# EAGLE board stm32 v1.2 (EAGLE 9.6.2), part 1 of 2
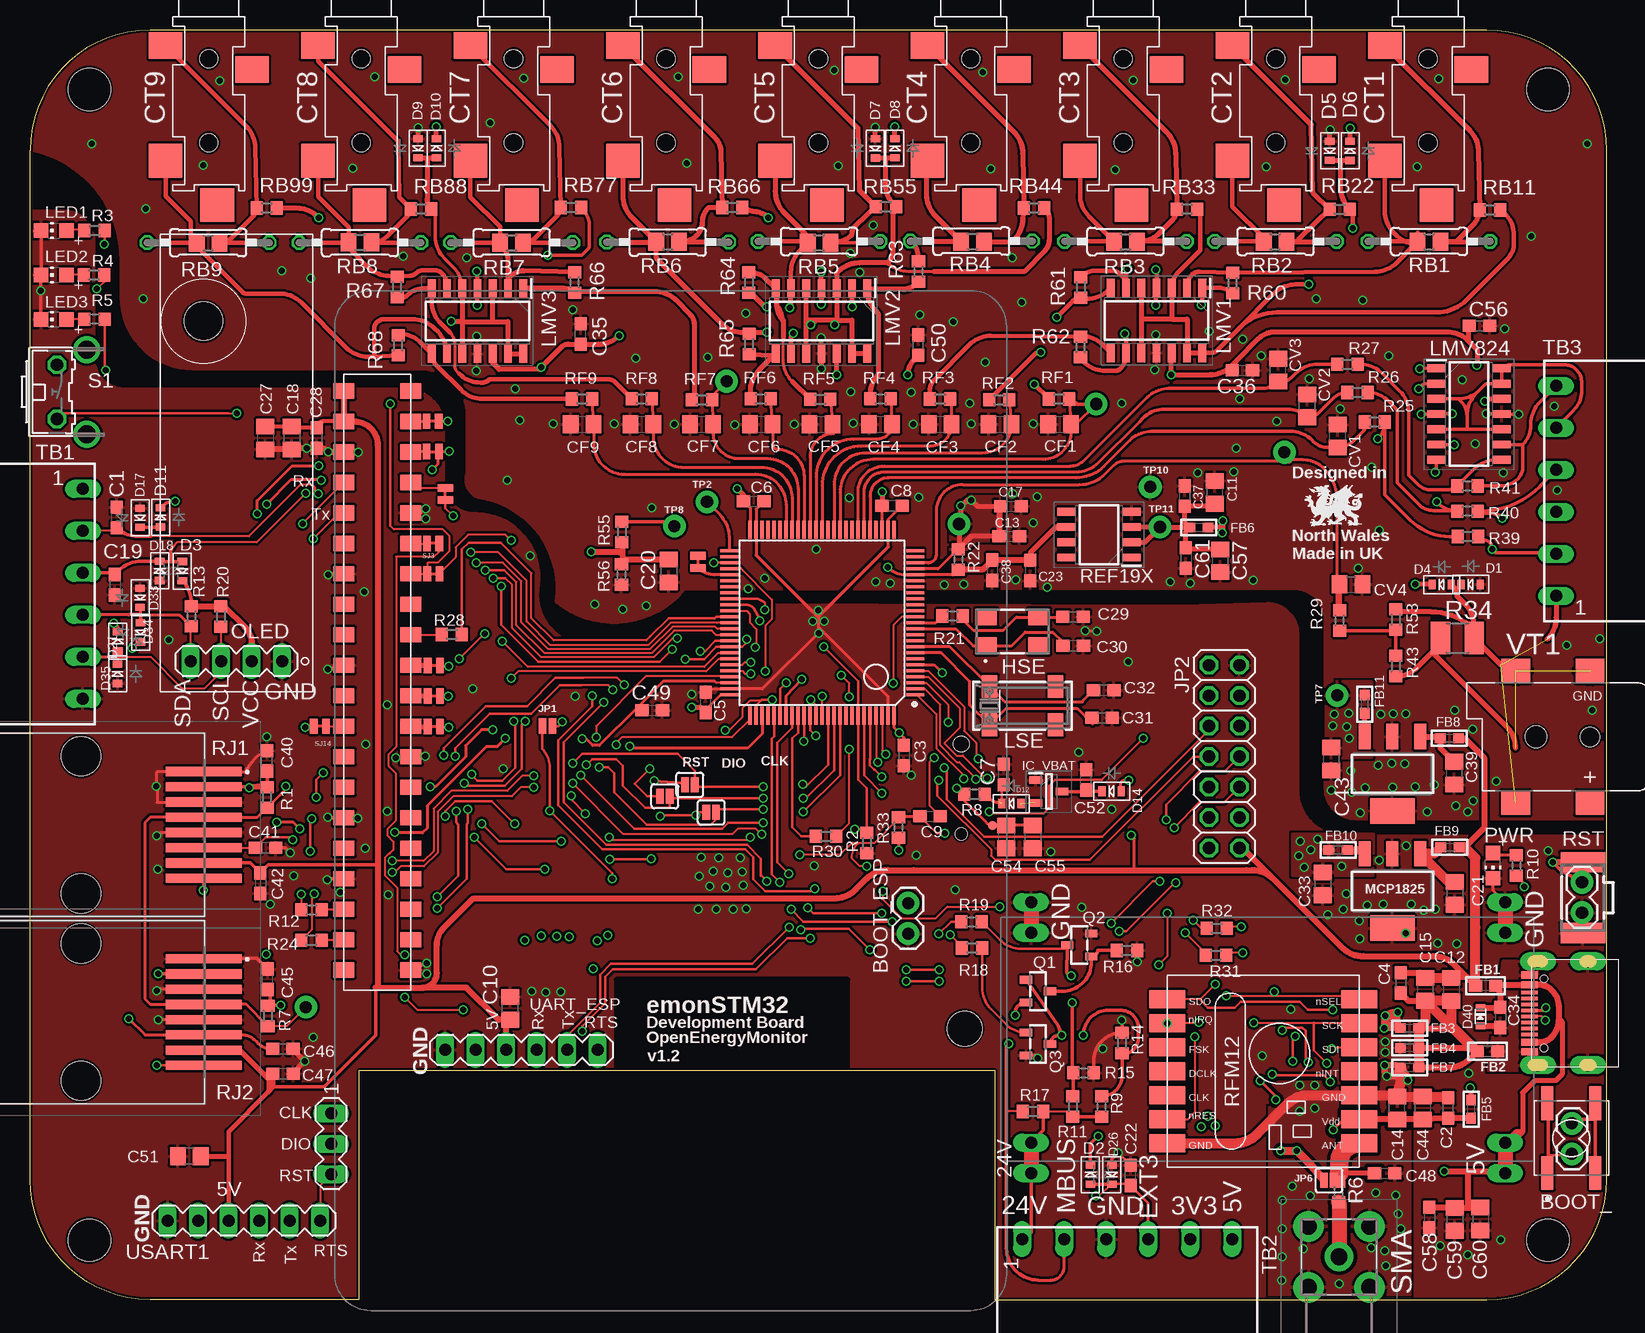
[diagram p5: board, top side]
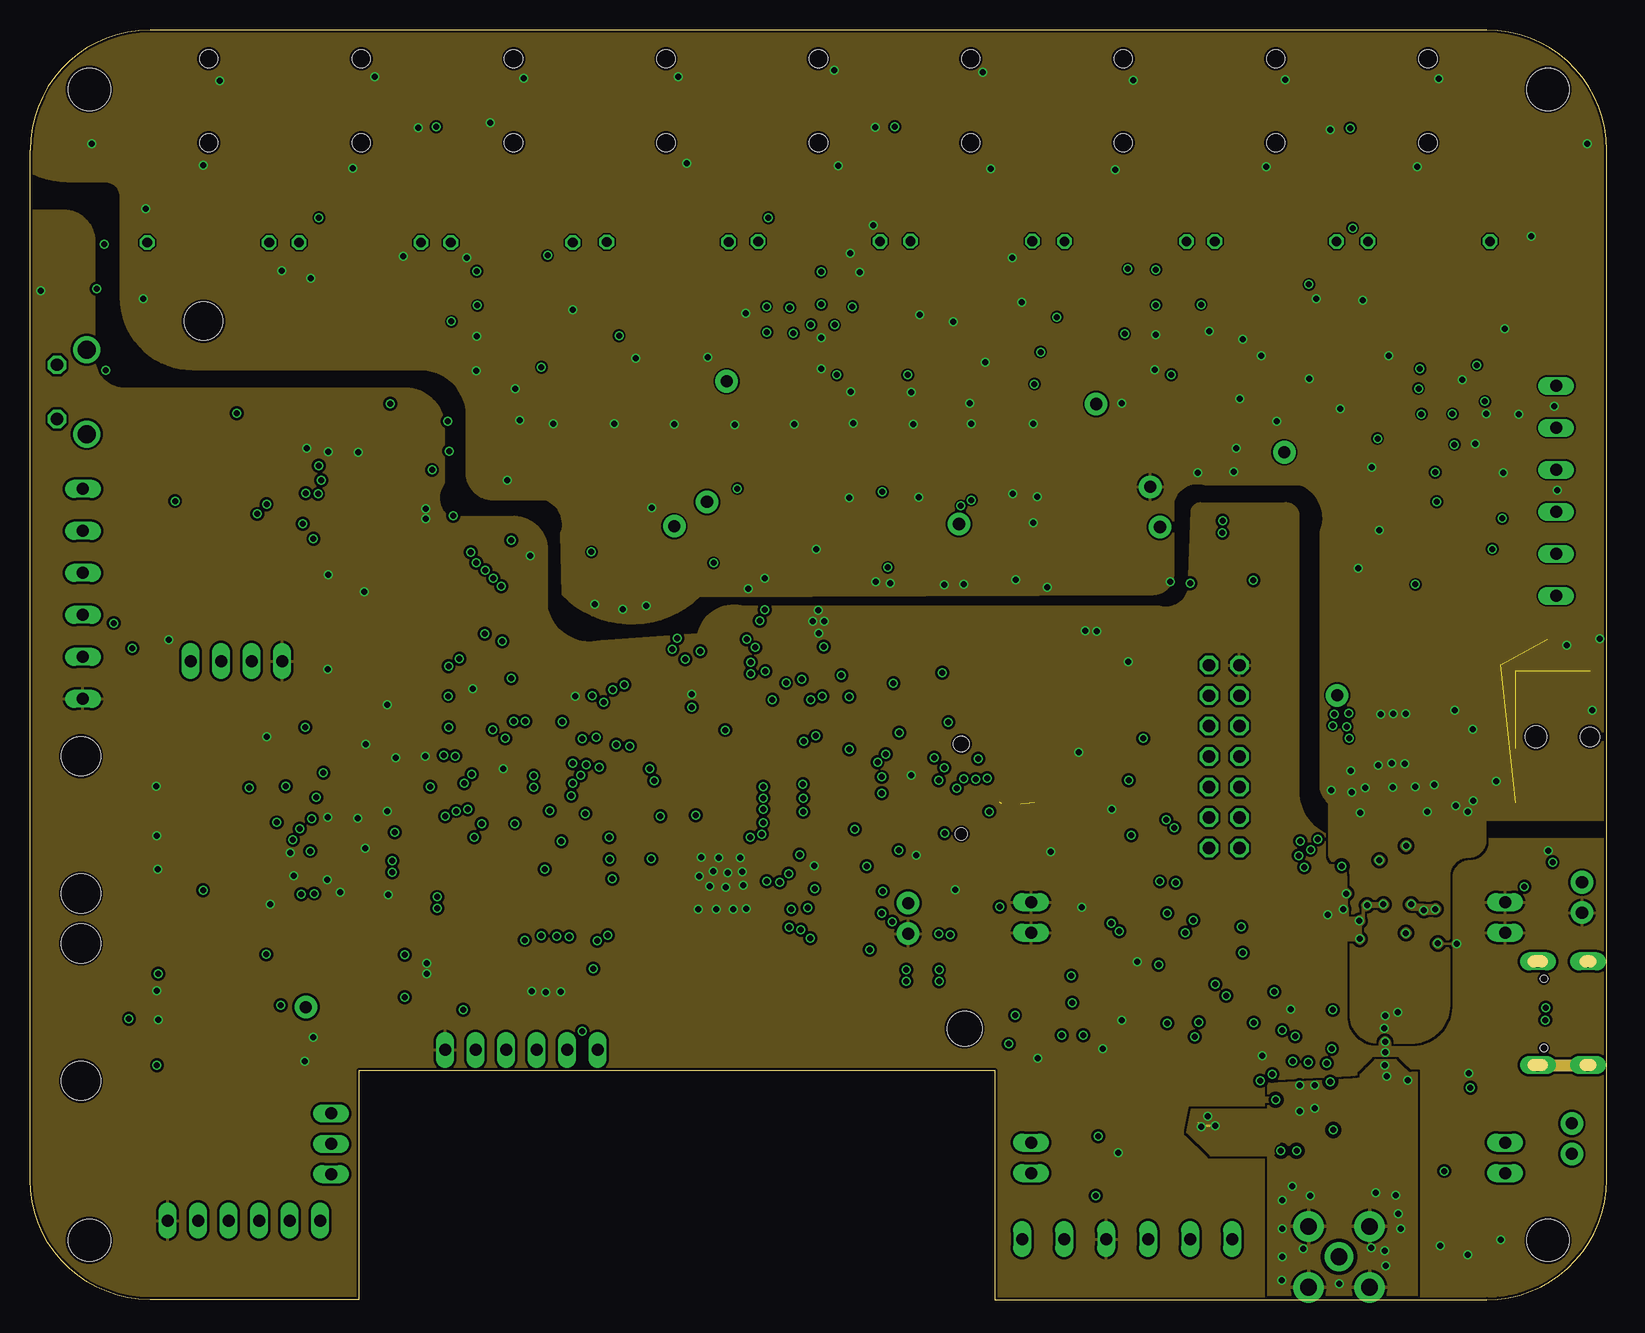
[diagram p6: board, inner layer GND]
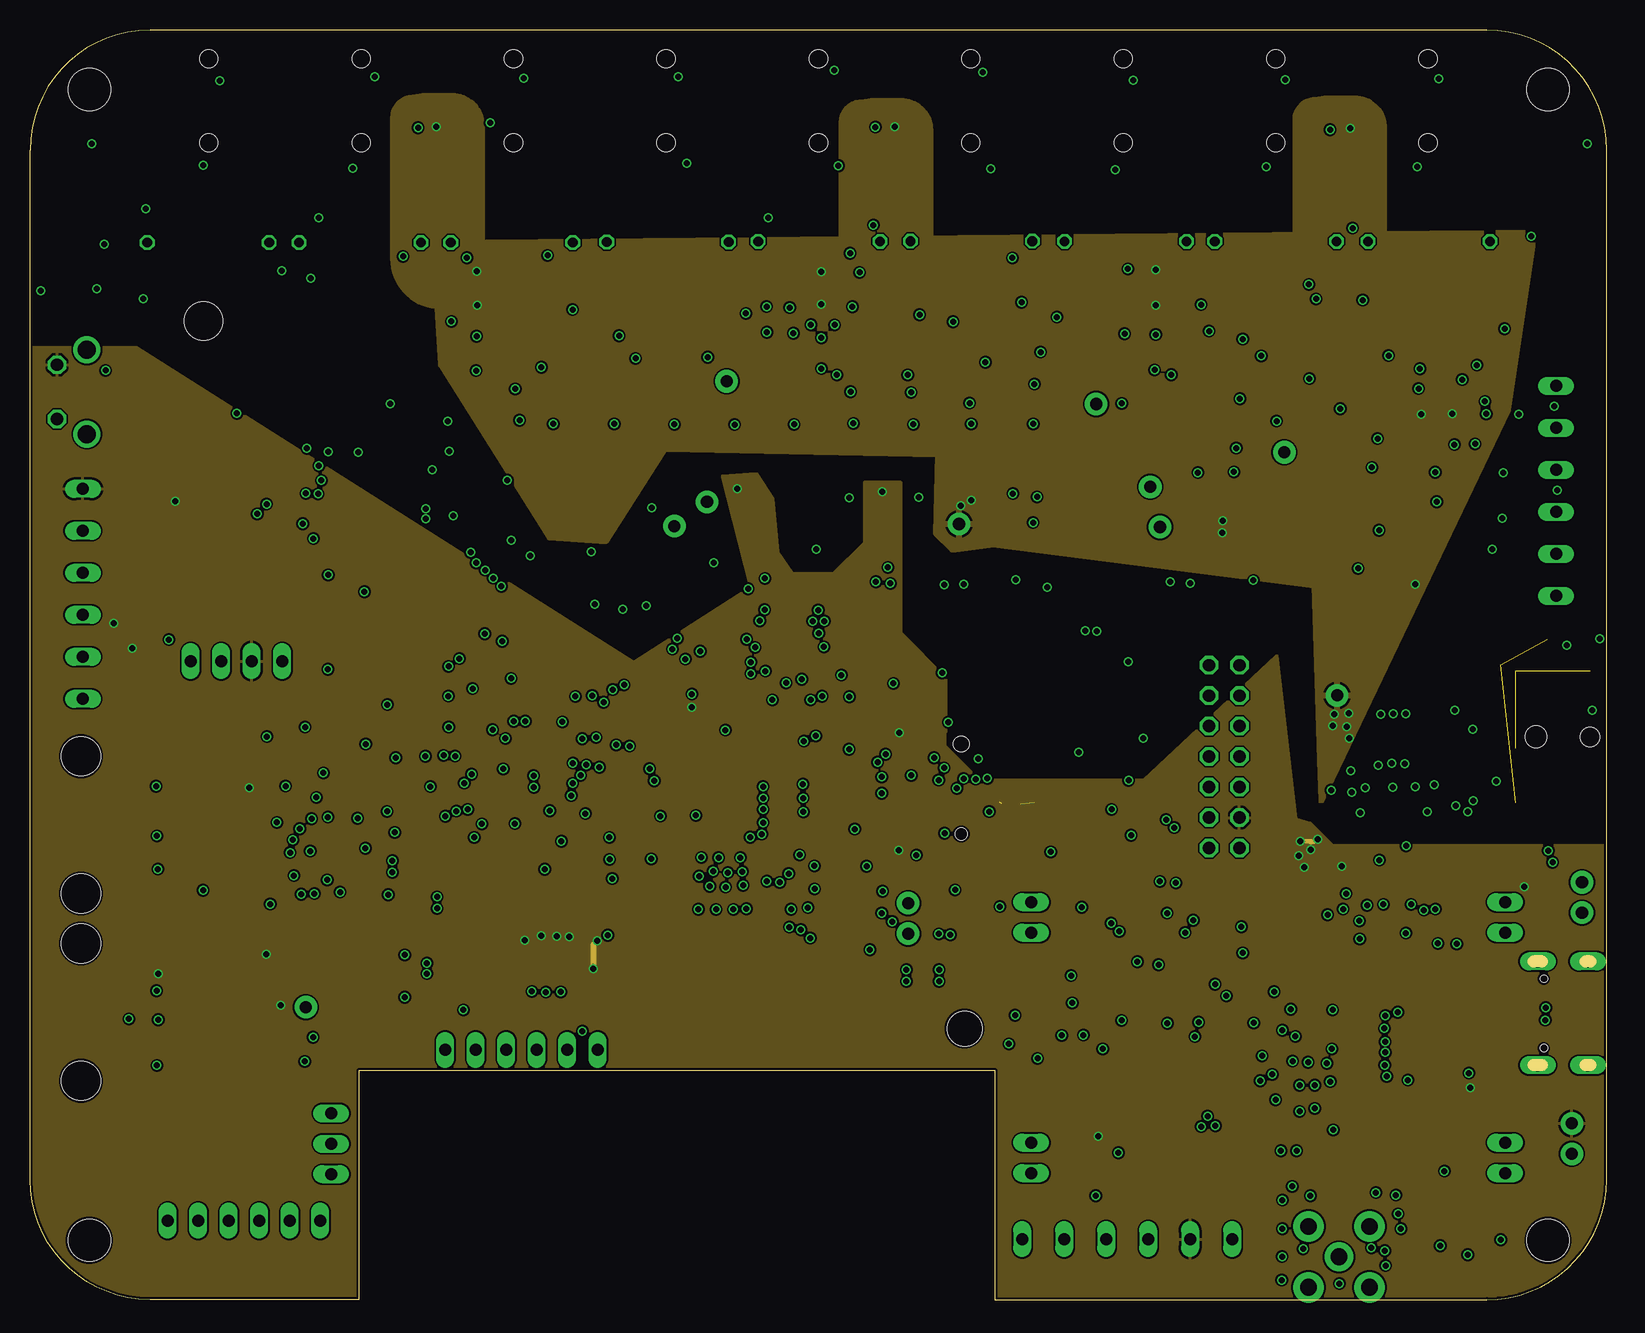
[diagram p7: board, inner layer +3V3]
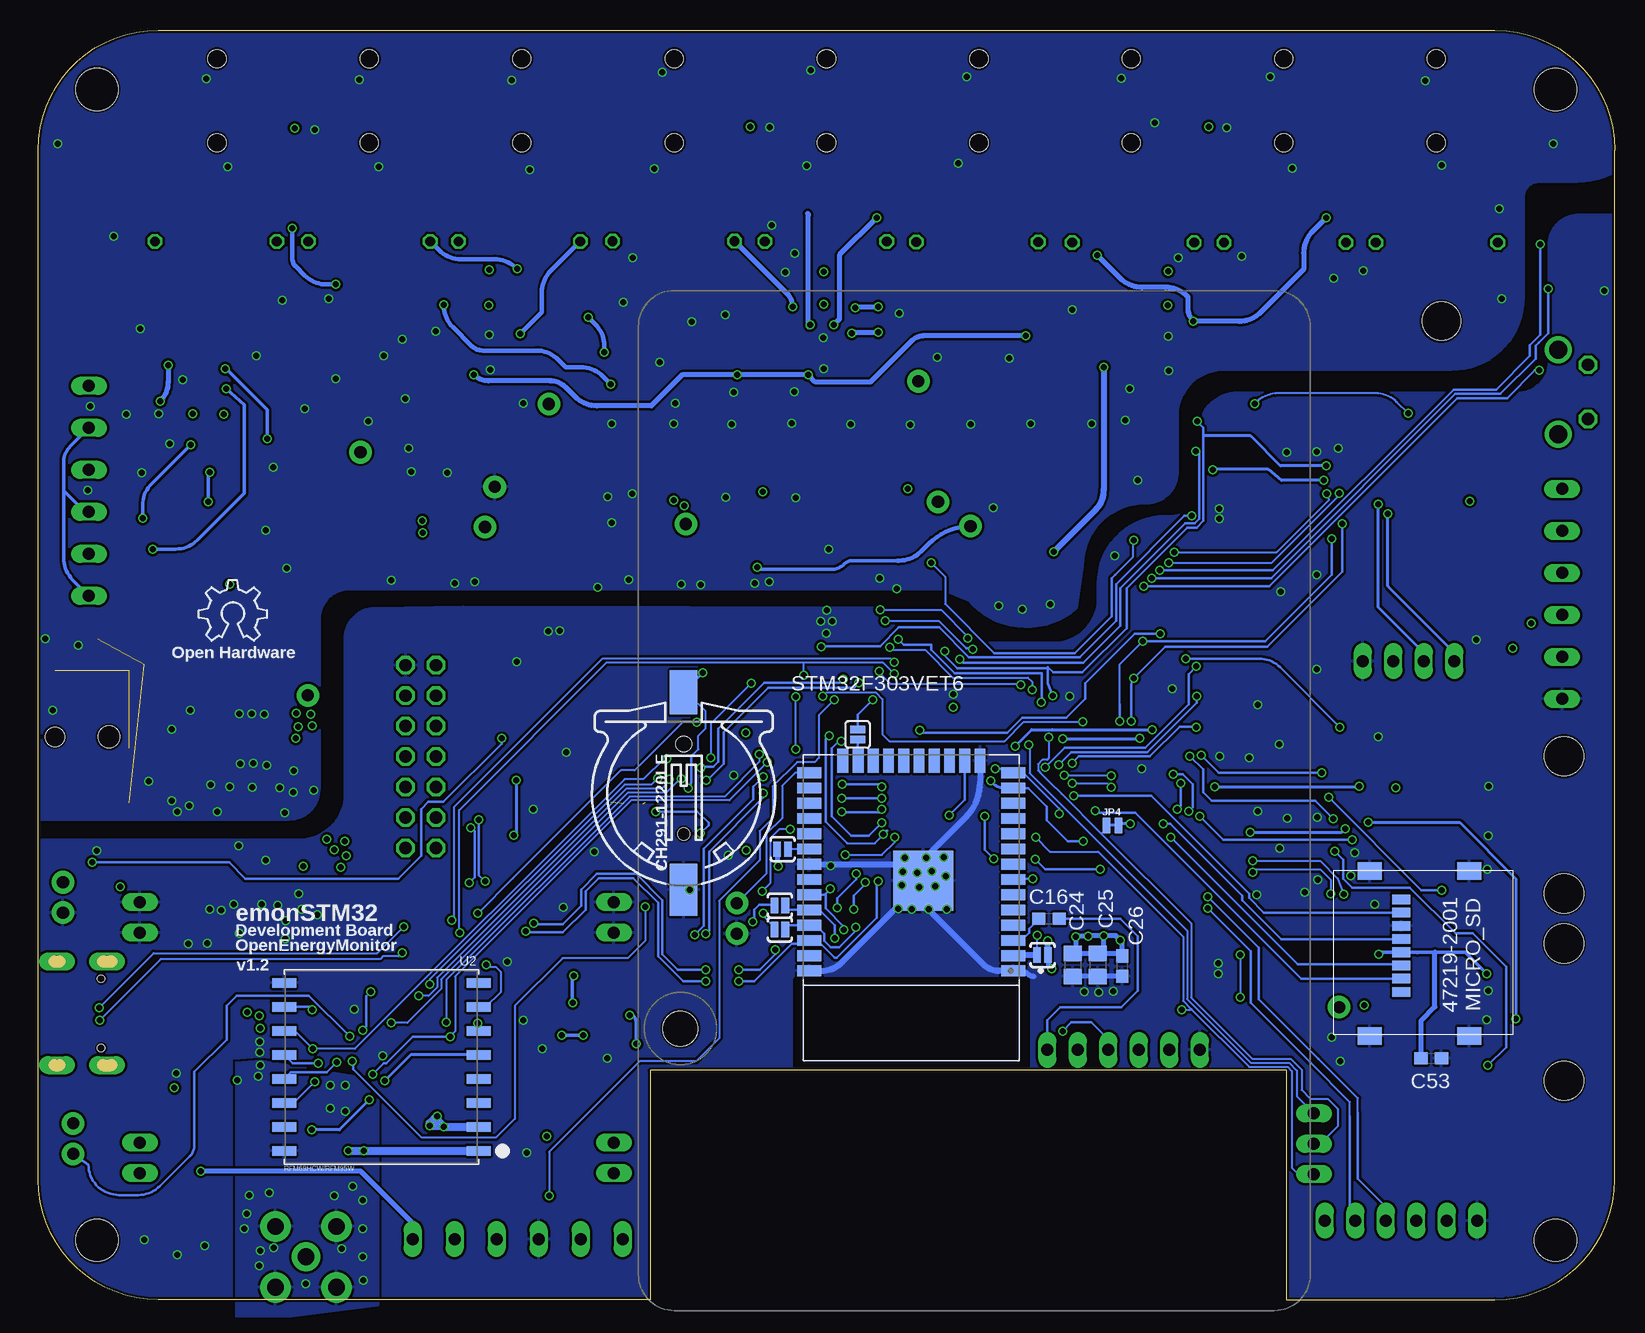
[diagram p8: board, bottom side, seen from below]

Size 131.4 x 105.8 mm. Coordinates in mm from the lower left corner, seen from the top.
Outline: 131.4,10 131.4,95.8 arc90 121.4,105.8 10,105.8 arc90 0,95.8 0,10 arc90 10,0 27.4,0 27.4,19.1 80.4,19.1 80.4,0 121.4,0 arc90 131.4,10
Copper layers (1+2*15+16): Top 0.035mm / dielectric 0.2mm / GND 0.018mm / dielectric 1.1mm / +3V3 0.018mm / dielectric 0.2mm / Bottom 0.035mm
Design rules "ragworm *": minimum track width 7mil, minimum drill 0.5mm, track to track 6mil, track to pad 6mil, pad to pad 7mil, via to via 8mil, smd to smd 0mil, copper to edge 8mil, drill to drill 10mil, minimum pad ring 3mil, minimum via ring 3mil, stop-mask expansion 2mil, vias tented up to drill 25mil, thermal gap 8mil
Net classes: 0 default: width 0.178 mm, drill 0.5 mm, clearance 0.152 mm; 1 power: width 0.254 mm, drill 0.5 mm, clearance 0.152 mm; 2 gnd: width 0.254 mm, drill 0.5 mm, clearance 0.152 mm; 3 ant: width 0.406 mm, drill 0.5 mm, clearance 0.254 mm; 4 cts_vts: width 0.254 mm, drill 0.5 mm, clearance 0.229 mm
Holes 3.5 mm at 126.5,100.85 4.95,100.85 4.95,4.95 126.5,4.95
Holes 3.18 mm at 14.46,81.54
tRestrict: area 48.8,18.3 to 68.2,26.7
bRestrict: area 49,18.3 to 68.3,26.7

## Footprints (pad centres in the part's own frame; a part is rotated, then mirrored left to right if it is on the bottom)
1X02 = drill 1.016 pad 1.88: 1 0,0; 2 2.54,0
KSC222JLFS = smd 2.8 x 1: 1 -2.9,2; 2 2.9,2; 3 2.9,-2; 4 -2.9,-2
C0603 = smd 1.1 x 1: 1 -0.85,0; 2 0.85,0
C0805 = smd 1.3 x 1.5: 1 -0.95,0; 2 0.95,0
SJ-352X-SMT = smd 2.8 x 2.2: P$1 -3.6,-2.4; P$3 3.6,-4.4 | smd 2.8 x 2.8: P$2 -3.6,-12; P$4 0.7,-15.7 | hole 1.5: 0,-3.5; 0,-10.5
SOD-523 = smd 0.8 x 0.6: A 0,-0.8; K 0,0.8
SOD-523' = smd 0.8 x 0.6: A 0,-0.75; K 0,0.75
0603 = smd 1.1 x 1: 1 -0.85,0; 2 0.85,0
_0603 = smd 0.9 x 0.8: 1 -0.762,0; 2 0.762,0
CH291-1220LF = smd 2.3 x 3.66: + 0,-2.296 | smd 2.3 x 4.3: - 0,14.146 | hole 1.3: 0,2 | hole 1: 0,9.5
ABMM2 = smd 1.8 x 1.4: 1 -2.2,-1.2; 2 2.2,-1.2; 3 2.2,1.2; 4 -2.2,1.2
SOT96P240X135-3N = smd 1.05 x 0.65: 1 -1.1,0.96; 2 -1.1,-0.96; 3 1.1,0
SMT-JUMPER_2_NC_TRACE_NO-SILK = smd 0.635 x 1.27: 1 -0.508,0; 2 0.508,0
SMT-JUMPER_2_NO_NO-SILK = smd 0.635 x 1.27: 1 -0.406,0; 2 0.406,0
2X07 = drill 1.016 octagon: 1 -7.62,-1.27; 2 -7.62,1.27; 3 -5.08,-1.27; 4 -5.08,1.27; 5 -2.54,-1.27; 6 -2.54,1.27; 7 0,-1.27; 8 0,1.27; 9 2.54,-1.27; 10 2.54,1.27; 11 5.08,-1.27; 12 5.08,1.27; 13 7.62,-1.27; 14 7.62,1.27
SMT-JUMPER_2_NC_PASTE_SILK = smd 0.635 x 1.27: 1 -0.406,0; 2 0.406,0
CHIP-LED0805 = smd 1.2 x 1.2: A 0,-1.05; C 0,1.05
SOIC127P600X175-14N = smd 1.525 x 0.65: 1 -2.712,3.81; 2 -2.712,2.54; 3 -2.712,1.27; 4 -2.712,0; 5 -2.712,-1.27; 6 -2.712,-2.54; 7 -2.712,-3.81; 8 2.712,-3.81; 9 2.712,-2.54; 10 2.712,-1.27; 11 2.712,0; 12 2.712,1.27; 13 2.712,2.54; 14 2.712,3.81
CRYSTAL_8X3.8 = smd 1.3 x 1.9: P$1 -2.75,-1.6; P$2 2.75,-1.6; P$3 2.75,1.6; P$4 -2.75,1.6
SOT-223 = smd 1 x 2.1: 1 -2.3,-3.1; 2 0,-3.1; 3 2.3,-3.1 | smd 3.7 x 2.1: 4 0,3.1
47219-2001_MICROSD = smd 1.45 x 2: P$1 0,0; P$2 13.75,0; P$3 0,8.3; P$4 13.75,8.3 | smd 0.8 x 1.5: PIN1 10.08,2.6; PIN2 8.98,2.6; PIN3 7.88,2.6; PIN4 6.78,2.6; PIN5 5.68,2.6; PIN6 4.58,2.6; PIN7 3.48,2.6; PIN8 2.38,2.6
MA04-1-OLED = drill 1 long: 1 -3.81,0; 2 -1.27,0; 3 1.27,0; 4 3.81,0
RPI3MIRROR2 = smd 1.27 x 1.778: P$41 8.371,6.351; P$42 8.371,0.763; P$43 10.911,6.351; P$44 10.911,0.763; P$45 13.451,6.351; P$46 13.451,0.763; P$47 15.991,6.351; P$48 15.991,0.763; P$49 18.531,6.351; P$50 18.531,0.763; P$51 21.071,6.351; P$52 21.071,0.763; P$53 23.611,6.351; P$54 23.611,0.763; P$55 26.151,6.351; P$56 26.151,0.763; P$57 28.691,6.351; P$58 28.691,0.763; P$59 31.231,6.351; P$60 31.231,0.763; P$61 33.771,6.351; P$62 33.771,0.763; P$63 36.311,6.351; P$64 36.311,0.763; P$65 38.851,6.351; P$66 38.851,0.763; P$67 41.391,6.351; P$68 41.391,0.763; P$69 43.931,6.351; P$70 43.931,0.763; P$71 46.471,6.351; P$72 46.471,0.763; P$73 49.011,6.351; P$74 49.011,0.763; P$75 51.551,6.351; P$76 51.551,0.763; P$77 54.091,6.351; P$78 54.091,0.763; P$79 56.631,6.351; P$80 56.631,0.763 | hole 2.9: 61.5,52.505
SOT23-R = smd 0.635 x 1.016: 1 -0.95,-1; 2 0.95,-1; 3 0,1
R0603 = smd 1 x 1.1: 1 -0.85,0; 2 0.85,0
R1210 = smd 1.6 x 2.7: 1 -1.4,0; 2 1.4,0
R0805 = smd 1.3 x 1.5: 1 -0.95,0; 2 0.95,0
0207/10 = drill 0.813 octagon: 1 -5.08,0; 2 5.08,0
SOIC127P599X175-8N = smd 1.526 x 0.65: 1 -2.712,1.905; 2 -2.712,0.635; 3 -2.712,-0.635; 4 -2.712,-1.905; 5 2.712,-1.905; 6 2.712,-0.635; 7 2.712,0.635; 8 2.712,1.905
RFM12 = smd 1.5 x 3: 1 -5,-10; 2 -3,-10; 3 -1,-10; 4 1,-10; 5 3,-10; 6 5,-10; 7 7,-10; 8 7,6; 9 5,6; 10 3,6; 11 1,6; 12 -1,6; 13 -3,6; 14 -5,6
955016889 = smd 0.76 x 6.35: 1 -4.445,8.975; 2 -3.175,8.975; 3 -1.905,8.975; 4 -0.635,8.975; 5 0.635,8.975; 6 1.905,8.975; 7 3.175,8.975; 8 4.445,8.975 | hole 3.25: -5.715,-1.25; 5.715,-1.25
KSS = smd 1.7 x 3.7: 1 -2.95,0; 2 2.95,0
B3F-31XX = drill 1.016 octagon: 1 -2.261,-1.245; 2 2.261,-1.245 | drill 1.499 pad 2.159: 3 -3.505,1.245; 4 3.505,1.245
SMT-JUMPER_2_NO_SILK = smd 0.635 x 1.27: 1 -0.406,0; 2 0.406,0
SJ_2S-NO = smd 0.635 x 1.27: 1 -0.45,0; 2 0.45,0
518144001 = drill 1.4 pad 2.4: 1 0,0 | drill 1.4 pad 2.55: 2 -2.54,2.54; 3 -2.54,-2.54; 4 2.54,-2.54; 5 2.54,2.54
TQFP100 = smd 0.27 x 1.5: 1 -6,-7.75; 2 -5.5,-7.75; 3 -5,-7.75; 4 -4.5,-7.75; 5 -4,-7.75; 6 -3.5,-7.75; 7 -3,-7.75; 8 -2.5,-7.75; 9 -2,-7.75; 10 -1.5,-7.75; 11 -1,-7.75; 12 -0.5,-7.75; 13 0,-7.75; 14 0.5,-7.75; 15 1,-7.75; 16 1.5,-7.75; 17 2,-7.75; 18 2.5,-7.75; 19 3,-7.75; 20 3.5,-7.75; 21 4,-7.75; 22 4.5,-7.75; 23 5,-7.75; 24 5.5,-7.75; 25 6,-7.75; 51 6,7.75; 52 5.5,7.75; 53 5,7.75; 54 4.5,7.75; 55 4,7.75; 56 3.5,7.75; 57 3,7.75; 58 2.5,7.75; 59 2,7.75; 60 1.5,7.75; 61 1,7.75; 62 0.5,7.75; 63 0,7.75; 64 -0.5,7.75; 65 -1,7.75; 66 -1.5,7.75; 67 -2,7.75; 68 -2.5,7.75; 69 -3,7.75; 70 -3.5,7.75; 71 -4,7.75; 72 -4.5,7.75; 73 -5,7.75; 74 -5.5,7.75; 75 -6,7.75 | smd 1.5 x 0.27: 26 7.75,-6; 27 7.75,-5.5; 28 7.75,-5; 29 7.75,-4.5; 30 7.75,-4; 31 7.75,-3.5; 32 7.75,-3; 33 7.75,-2.5; 34 7.75,-2; 35 7.75,-1.5; 36 7.75,-1; 37 7.75,-0.5; 38 7.75,0; 39 7.75,0.5; 40 7.75,1; 41 7.75,1.5; 42 7.75,2; 43 7.75,2.5; 44 7.75,3; 45 7.75,3.5; 46 7.75,4; 47 7.75,4.5; 48 7.75,5; 49 7.75,5.5; 50 7.75,6; 76 -7.75,6; 77 -7.75,5.5; 78 -7.75,5; 79 -7.75,4.5; 80 -7.75,4; 81 -7.75,3.5; 82 -7.75,3; 83 -7.75,2.5; 84 -7.75,2; 85 -7.75,1.5; 86 -7.75,1; 87 -7.75,0.5; 88 -7.75,0; 89 -7.75,-0.5; 90 -7.75,-1; 91 -7.75,-1.5; 92 -7.75,-2; 93 -7.75,-2.5; 94 -7.75,-3; 95 -7.75,-3.5; 96 -7.75,-4; 97 -7.75,-4.5; 98 -7.75,-5; 99 -7.75,-5.5; 100 -7.75,-6
MA06-1 = drill 1 long: 1 -6.35,0; 2 -3.81,0; 3 -1.27,0; 4 1.27,0; 5 3.81,0; 6 6.35,0
MA03-1 = drill 1 long: 1 -2.54,0; 2 0,0; 3 2.54,0
3.5MM_X6 = drill 1 long: P$1 3,8.75; P$2 3,5.25; P$3 3,1.75; P$4 3,-1.75; P$5 3,-5.25; P$6 3,-8.75
1X01_NO_SILK = drill 1.016 pad 1.88: 1 0,0
PAD.03X.03 = smd 0.762 x 0.762: P$1 0,0
MODULE_ESP32-WROOM-32D = smd 2 x 0.9: 1 -8.5,5.26; 2 -8.5,3.99; 3 -8.5,2.72; 4 -8.5,1.45; 5 -8.5,0.18; 6 -8.5,-1.09; 7 -8.5,-2.36; 8 -8.5,-3.63; 9 -8.5,-4.9; 10 -8.5,-6.17; 11 -8.5,-7.44; 12 -8.5,-8.71; 13 -8.5,-9.98; 14 -8.5,-11.25; 25 8.5,-11.25; 26 8.5,-9.98; 27 8.5,-8.71; 28 8.5,-7.44; 29 8.5,-6.17; 30 8.5,-4.9; 31 8.5,-3.63; 32 8.5,-2.36; 33 8.5,-1.09; 34 8.5,0.18; 35 8.5,1.45; 36 8.5,2.72; 37 8.5,3.99; 38 8.5,5.26 | smd 0.9 x 2: 15 -5.715,-12.25; 16 -4.445,-12.25; 17 -3.175,-12.25; 18 -1.905,-12.25; 19 -0.635,-12.25; 20 0.635,-12.25; 21 1.905,-12.25; 22 3.175,-12.25; 23 4.445,-12.25; 24 5.715,-12.25 | smd 5 x 5: 39 -1,-2.24
RFMHCW_SMT = smd 2 x 0.8: 1P 8.1,-7; 2P 8.1,-5; 3P 8.1,-3; 4P 8.1,-1; 5P 8.1,1; 6P 8.1,3; 7P 8.1,5; 8P 8.1,7; 9P -8.1,7; 10P -8.1,5; 11P -8.1,3; 12P -8.1,1; 13P -8.1,-1; 14P -8.1,-3; 15P -8.1,-5; 16P -8.1,-7
BOOST = drill 1 long: IN+ 17.5,39.5; IN+1 20.04,39.5; OUT+ 17.5,0; OUT+1 20.04,0; P$1 0,0; P$2 0,39.5; P$3 -2.54,0; P$4 -2.54,39.5
USB-C = smd 0.6 x 1.4: A1/B12 -3.2,0.7; A4/B9 -2.4,0.7; B1/A12 3.2,0.7; B4/A9 2.4,0.7 | smd 0.3 x 1.4: A5 -1.25,0.7; A6 -0.25,0.7; A7 0.25,0.7; A8 1.25,0.7; B5 1.75,0.7; B6 0.75,0.7; B7 -0.75,0.7; B8 -1.75,0.7 | drill 1 pad 1.2 long: GND1 -4.32,0; GND2 4.33,0; GND3 4.33,-4.18; GND4 -4.32,-4.18 | hole 0.6: -2.89,-0.5; 2.89,-0.5
DCJACK_2MM_SMT = smd 2.4 x 2: GND 0,-5.5; GNDBREAK 6.2,-5.5; PWR1 0,5.5; PWR2 6.2,5.5 | hole 1.6: 0,0 | hole 1.8: 4.5,0

## Placement (x,y rotation side)
BOOT  [1X02]  128.48,14.69 270 top
BOOT_  KSC222JLFS  [KSC222JLFS]  128.45,13.46 90 top
BOOT_ESP  [1X02]  73.18,30.5 90 top
C1  100nF  [C0603]  7.23,65.18 90 top
C2  100nF  [C0603]  118.19,15.97 90 top
C3  100nF  [C0603]  72.83,45.33 270 top
C4  100nF  [C0603]  114.22,26.39 270 top
C5  100nF  [C0603]  56.33,49.77 90 top
C6  100nF  [C0603]  60.31,66.53 0 top
C7  2.2uF  [C0603]  81.16,43.76 90 top
C8  100nF  [C0603]  71.85,66.17 0 top
C9  2.2uF  [C0603]  75.02,40.27 0 top
C10  22uF  [C0805]  40.03,24.27 90 top
C11  22uF  [C0805]  98.75,67.27 90 top
C12  22uF  [C0805]  118.45,25.84 270 top
C13  2.2uF  [C0603]  81.6,63.61 0 top
C14  22uF  [C0805]  113.92,15.97 90 top
C15  22uF  [C0805]  116.25,25.85 270 top
C16  100nF  [C0603]  47.17,31.73 180 bottom
C17  100nF  [C0603]  81.74,66.12 0 top
C18  22uF  [C0805]  21.8,71.8 270 top
C19  100nF  [C0603]  7.08,59.57 270 top
C20  22uF  [C0805]  53.22,60.72 270 top
C21  22uF  [C0805]  118.72,33.85 270 top
C22  100nF  [C0603]  91.72,10.36 90 top
C23  2.2uf  [C0603]  83.36,60.76 270 top
C24  22uF  [C0805]  45.19,27.88 270 bottom
C25  22uF  [C0805]  43.1,27.88 270 bottom
C26  2.2uF  [C0603]  41.08,27.79 270 bottom
C27  22uF  [C0805]  19.6,71.8 270 top
C28  2.2uF  [C0603]  23.9,71.8 270 top
C29  15pF  [C0603]  86.92,56.91 0 top
C30  15pF  [C0603]  86.93,54.5 0 top
C31  10pF  [C0603]  89.35,48.47 0 top
C32  10pF  [C0603]  89.48,50.79 0 top
C33  22uF  [C0805]  107.73,34.64 270 top
C34  100nF  [C0603]  122.53,23.52 270 top
C35  100nF  [C0603]  45.89,80.47 90 top
C36  100nF  [C0603]  101.03,77.44 0 top
C37  100nF  [C0603]  96.25,66.96 90 top
C38  100nF  [C0603]  80.18,60.78 270 top
C39  22uF  [C0805]  118.67,43.87 270 top
C40  100nF  [C0603]  19.75,44.9 90 top
C41  100nF  [C0603]  19.64,37.67 0 top
C42  100nF  [C0603]  19.2,34.7 270 top
C43  22uF  [C0805]  108.42,45.05 270 top
C44  22uF  [C0805]  116.08,15.97 90 top
C45  100nF  [C0603]  19.8,26.7 90 top
C46  100nF  [C0603]  21.07,20.89 0 top
C47  100nF  [C0603]  21.08,18.84 0 top
C48  [C0603]  112.89,10.52 0 top
C49  100nF  [C0603]  51.86,49.1 0 top
C50  100nF  [C0603]  74.04,79.53 90 top
C51  22uF  [C0805]  13.28,11.96 180 top
C52  2.2uF  [C0603]  88,43.31 90 top
C53  100nF  [C0603]  15.31,20.11 0 bottom
C54  22uF  [C0805]  81.36,38.56 270 top
C55  22uF  [C0805]  83.55,38.56 270 top
C56  100nF  [C0603]  120.79,81.16 0 top
C57  22uF  [C0805]  99.17,61.57 270 top
C58  100nF  [C0603]  116.62,6.84 270 top
C59  22uF  [C0805]  118.74,6.69 270 top
C60  22uF  [C0805]  120.87,6.71 270 top
C61  100nF  [C0603]  96.32,61.8 270 top
CF1  10nF 5%  [C0805]  85.8,72.95 0 top
CF2  10nF 5%  [C0805]  80.83,72.95 0 top
CF3  10nF 5%  [C0805]  75.86,72.95 0 top
CF4  10nF 5%  [C0805]  70.88,72.95 0 top
CF5  10nF 5%  [C0805]  65.91,72.95 0 top
CF6  10nF 5%  [C0805]  60.94,72.95 0 top
CF7  10nF 5%  [C0805]  55.96,72.95 0 top
CF8  10nF 5%  [C0805]  50.99,72.95 0 top
CF9  10nF 5%  [C0805]  46.02,72.95 0 top
CT1  SJ-3523-SMT  [SJ-352X-SMT]  116.5,106.9 0 top
CT2  SJ-3523-SMT  [SJ-352X-SMT]  103.8,106.9 0 top
CT3  SJ-3523-SMT  [SJ-352X-SMT]  91.1,106.9 0 top
CT4  SJ-3523-SMT  [SJ-352X-SMT]  78.4,106.9 0 top
CT5  SJ-3523-SMT  [SJ-352X-SMT]  65.7,106.9 0 top
CT6  SJ-3523-SMT  [SJ-352X-SMT]  53,106.9 0 top
CT7  SJ-3523-SMT  [SJ-352X-SMT]  40.3,106.9 0 top
CT8  SJ-3523-SMT  [SJ-352X-SMT]  27.6,106.9 0 top
CT9  SJ-3523-SMT  [SJ-352X-SMT]  14.9,106.9 0 top
CV1  10nF 5%  [C0805]  108.97,71.97 90 top
CV2  10nF 5%  [C0805]  106.43,74.48 90 top
CV3  10nF 5%  [C0805]  104,77.45 90 top
CV4  10nF 5%  [C0805]  110.09,59.59 0 top
D1  [SOD-523]  120.04,59.6 90 top
D2  ESD5Z3.3T1G  [SOD-523]  88.37,10.41 0 top
D3  ESD5Z3.3T1G  [SOD-523]  12.69,60.7 180 top
D4  [SOD-523]  117.64,59.58 90 top
D5  [SOD-523]  108.31,95.74 180 top
D6  [SOD-523]  110.01,95.72 0 top
D7  [SOD-523]  70.44,95.94 180 top
D8  [SOD-523]  72.07,95.94 0 top
D9  [SOD-523]  32.34,95.94 180 top
D10  [SOD-523]  33.86,95.95 0 top
D11  ESD5Z3.3T1G  [SOD-523]  10.88,65.18 0 top
D12  [SOD-523]  81.78,41.33 90 top
D14  ESD5Z3.3T1G  [SOD-523]  90.13,42.36 90 top
D17  ESD5Z3.3T1G  [SOD-523]  9.18,65.15 180 top
D18  ESD5Z3.3T1G  [SOD-523]  10.81,60.72 0 top
D21  ESD5Z3.3T1G  [SOD-523]  9.21,55.6 180 top
D26  ESD5Z3.3T1G  [SOD-523]  90.17,10.42 180 top
D33  ESD5Z3.3T1G  [SOD-523]  9.17,58.49 180 top
D34  ESD5Z3.3T1G  [SOD-523]  7.32,54.85 0 top
D35  ESD5Z3.3T1G  [SOD-523]  7.3,52.15 0 top
D40  ESD5Z5.0T1G  [SOD-523']  120.87,23.58 0 top
FB1  600R  [0603]  121.31,26.16 180 top
FB2  0R  [0603]  121.46,20.68 180 top
FB3  0R  [_0603]  114.97,22.62 180 top
FB4  0R  [_0603]  114.97,20.98 180 top
FB5  0R  [_0603]  120.1,15.87 90 top
FB6  600R  [_0603]  97.41,64.34 0 top
FB7  0R  [_0603]  114.97,19.34 180 top
FB8  600R  [_0603]  118.29,46.78 0 top
FB9  600R  [_0603]  118.32,37.7 0 top
FB10  0R  [_0603]  109,37.46 180 top
FB11  0R  [_0603]  111.23,49.62 90 top
G1  CH291-1220LF  [CH291-1220LF]  77.61,48.3 180 bottom
HSE  6MM_3.5MM_CRYSTAL  [ABMM2]  81.88,55.68 0 top
IC_VBAT  AP7313-33SRG-7  [SOT96P240X135-3N]  84.91,42.34 0 top
J1  JUMPER-SMT_2_NC_TRACE_NO-SILK  [SMT-JUMPER_2_NC_TRACE_NO-SILK]  34.62,67.13 90 top
JP1  JUMPER-SMT_2_NO_NO-SILK  [SMT-JUMPER_2_NO_NO-SILK]  43.13,47.8 0 top
JP2  PINHD-2X7  [2X07]  99.52,45.25 270 top
JP4  JUMPER-SMT_2_NC_TRACE_NO-SILK  [SMT-JUMPER_2_NC_TRACE_NO-SILK]  41.87,39.52 180 bottom
JP6  JUMPER-SMT_2_NC_PASTE_SILK  [SMT-JUMPER_2_NC_PASTE_SILK]  108.24,9.94 0 top
LED1  Green  [CHIP-LED0805]  1.98,89.08 90 top
LED2  Yellow  [CHIP-LED0805]  1.98,85.38 90 top
LED3  Blue  [CHIP-LED0805]  1.98,81.68 90 top
LMV1  LMV824IDG4  [SOIC127P600X175-14N]  93.88,81.6 270 top
LMV2  LMV824IDG4  [SOIC127P600X175-14N]  65.95,81.56 270 top
LMV3  LMV824IDG4  [SOIC127P600X175-14N]  37.29,81.55 270 top
LMV824  LMV824IDG4  [SOIC127P600X175-14N]  119.92,73.79 0 top
LOGO1  OSHW_LOGO_6MILX0200-NT  [OSHW_6X200_NOTEXT]  118.01,54.9 0 bottom
LSE  32.768kHz  [CRYSTAL_8X3.8]  82.71,49.5 0 top
MCP1825  MCP1825SOT-223-3  [SOT-223]  113.54,34.06 180 top
MCP1825(ANALOG)  MCP1825SOT-223-3  [SOT-223]  113.54,43.82 180 top
MICROSD  47219-2001_MICROSD  [47219-2001_MICROSD]  20.43,35.73 270 bottom
OLED  [MA04-1-OLED]  17.2,53.2 0 top
PCB2  RPI3YA  [RPI3MIRROR2]  25.38,84.09 270 top
PWR  Green  [CHIP-LED0805]  121.91,36.16 180 top
Q1  PNP  [SOT23-R]  84,25.7 270 top
Q2  NPN  [SOT23-R]  87.44,29.55 90 top
Q3  NPN  [SOT23-R]  84,21.3 270 top
R1  4.7k  [R0603]  19.75,41.85 90 top
R2  10k  [R0603]  69.73,38.04 270 top
R3  330R  [R0603]  5.38,89.08 0 top
R4  330R  [R0603]  5.33,85.38 0 top
R5  330R  [R0603]  5.37,81.71 0 top
R6  0R  [R0603]  109.06,8.96 90 top
R7  4.7k  [R0603]  19.83,23.65 90 top
R8  10k  [R0603]  78.72,42.11 180 top
R9  39K  [R0603]  89.3,16.1 270 top
R10  330R  [R0603]  123.86,36.18 270 top
R11  33K  [R0603]  86.9,16.1 270 top
R12  10k  [R0603]  23.46,32.48 180 top
R13  10k  [R0603]  13.44,56.95 90 top
R14  22K  [R0603]  91,21.4 270 top
R15  3k3  [R0603]  87.8,18.9 180 top
R16  82R  [R0603]  91.4,29.1 180 top
R17  220k  [R0603]  83.58,15.68 0 top
R18  1k5  [R0603]  78.5,29.3 180 top
R19  1k5  [R0603]  78.46,31.48 180 top
R20  10k  [R0603]  15.9,56.91 90 top
R21  2k  [R0603]  76.88,56.96 0 top
R22  [R0603]  77.36,61.68 270 top
R24  10k  [R0603]  23.45,29.95 180 top
R25  9k1 0.1%  [R0603]  112.07,73.13 180 top
R26  9k1 0.1%  [R0603]  110.64,75.59 180 top
R27  9k1 0.1%  [R0603]  109.79,77.94 180 top
R28  10k  [R0603]  35.15,55.43 180 top
R29  0R  [R0603]  109.14,56.6 90 top
R30  1k5  [R0603]  66.34,38.61 180 top
R31  20R  [R0603]  98.83,28.69 180 top
R32  20R  [R0603]  98.9,30.94 180 top
R33  10k  [R0603]  72.37,39.34 90 top
R34  [R1210]  118.95,55.12 0 top
R39  330R  [R0603]  119.82,63.59 0 top
R40  330R  [R0603]  119.81,65.7 0 top
R41  330R  [R0603]  119.79,67.81 180 top
R43  140k  [R0603]  113.82,52.78 270 top
R53  10k  [R0603]  113.82,56.66 90 top
R55  10k  [R0603]  49.32,63.96 90 top
R56  10k  [R0603]  49.28,60.41 90 top
R60  510R 0.1%  [R0603]  100.23,84.7 90 top
R61  510R 0.1%  [R0603]  87.57,84.35 90 top
R62  510R 0.1%  [R0603]  87.54,79.37 90 top
R63  510R 0.1%  [R0603]  74.04,85.66 90 top
R64  510R 0.1%  [R0603]  59.9,84.75 270 top
R65  510R 0.1%  [R0603]  59.93,79.63 270 top
R66  510R 0.1%  [R0603]  45.39,84.77 90 top
R67  510R 0.1%  [R0603]  30.59,84.38 90 top
R68  510R 0.1%  [R0603]  30.68,79.53 90 top
RB1  6R81  [R0805]  116.59,88.16 0 top
RB1_  [0207/10]  116.59,88.18 0 top
RB2  6R81  [R0805]  103.76,88.16 0 top
RB2_  [0207/10]  103.8,88.18 0 top
RB3  6R81  [R0805]  91.3,88.16 0 top
RB3_  [0207/10]  91.3,88.18 0 top
RB4  6R81  [R0805]  78.54,88.17 0 top
RB4_  [0207/10]  78.45,88.21 0 top
RB5  6R81  [R0805]  65.76,88.08 0 top
RB5_  [0207/10]  65.76,88.18 0 top
RB6  6R81  [R0805]  53.14,88.15 0 top
RB6_  [0207/10]  53.14,88.13 0 top
RB7  6R81  [R0805]  40.12,88.07 0 top
RB7_  [0207/10]  40.15,88.08 0 top
RB8  6R81  [R0805]  27.5,88.11 0 top
RB8_  [0207/10]  27.5,88.08 0 top
RB9  6R81  [R0805]  14.85,88.08 0 top
RB9_  [0207/10]  14.85,88.08 0 top
RB11  680R | 681R 0.1%  [R0603]  121.65,90.8 0 top
RB22  680R | 681R 0.1%  [R0603]  109.15,90.86 0 top
RB33  680R | 681R 0.1%  [R0603]  96.41,90.87 0 top
RB44  680R | 681R 0.1%  [R0603]  83.67,90.97 0 top
RB55  680R | 681R 0.1%  [R0603]  71.32,91.07 0 top
RB66  680R | 681R 0.1%  [R0603]  58.52,91.01 0 top
RB77  680R | 681R 0.1%  [R0603]  45.07,91 0 top
RB88  680R | 681R 0.1%  [R0603]  32.58,90.89 0 top
RB99  680R | 681R 0.1%  [R0603]  19.73,90.97 0 top
REF19X  REF191ESZ  [SOIC127P599X175-8N]  89.09,63.75 180 top
RF1  9k1 0.1%  [R0603]  85.76,75.05 0 top
RF2  9k1 0.1%  [R0603]  80.77,74.98 0 top
RF3  9k1 0.1%  [R0603]  75.84,75.05 0 top
RF4  9k1 0.1%  [R0603]  70.89,75.06 0 top
RF5  9k1 0.1%  [R0603]  65.85,75.03 0 top
RF6  9k1 0.1%  [R0603]  60.89,75.06 0 top
RF7  9k1 0.1%  [R0603]  55.99,74.98 0 top
RF8  9k1 0.1%  [R0603]  50.98,75.07 0 top
RF9  9k1 0.1%  [R0603]  46,75.06 0 top
RFM69HCW  RFM12_SMDSMD  [RFM12]  104.78,20.03 270 top
RJ1  95501-6889  [955016889]  5.5,39.56 270 top
RJ2  95501-6889  [955016889]  5.5,23.96 270 top
RST  KSS221GLFS  [KSS]  129.4,33.5 90 top
RST_STM  [1X02]  129.33,34.78 270 top
S1  [B3F-31XX]  3.5,75.64 270 top
SJ1  JUMPER-SMT_2_NC_TRACE_NO-SILK  [SMT-JUMPER_2_NC_TRACE_NO-SILK]  55.67,61.48 90 top
SJ3  JUMPER-SMT_2_NC_TRACE_NO-SILK  [SMT-JUMPER_2_NC_TRACE_NO-SILK]  33.61,60.48 0 top
SJ4  JUMPER-SMT_2_NO_SILK  [SMT-JUMPER_2_NO_SILK]  52.91,41.95 0 top
SJ5  JUMPER-SMT_2_NC_TRACE_NO-SILK  [SMT-JUMPER_2_NC_TRACE_NO-SILK]  33.66,52.83 180 top
SJ6  JUMPER-SMT_2_NC_TRACE_NO-SILK  [SMT-JUMPER_2_NC_TRACE_NO-SILK]  33.66,50.29 180 top
SJ7  JUMPER-SMT_2_NC_TRACE_NO-SILK  [SMT-JUMPER_2_NC_TRACE_NO-SILK]  33.66,47.75 180 top
SJ9  JUMPER-SMT_2_NO_SILK  [SMT-JUMPER_2_NO_SILK]  56.76,40.61 0 top
SJ10  JUMPER-SMT_2_NO_SILK  [SMT-JUMPER_2_NO_SILK]  54.98,42.9 0 top
SJ13  JUMPER-SMT_2_NO_SILK  [SMT-JUMPER_2_NO_SILK]  63.1,47.09 90 bottom
SJ14  JUMPER-SMT_2_NC_TRACE_NO-SILK  [SMT-JUMPER_2_NC_TRACE_NO-SILK]  24.16,47.78 180 top
SJ20  SOLDERJUMPERNO  [SJ_2S-NO]  69.59,30.84 0 bottom
SJ21  SOLDERJUMPERNO  [SJ_2S-NO]  69.59,32.84 0 bottom
SJ23  SOLDERJUMPERNO  [SJ_2S-NO]  47.7,28.72 0 bottom
SJ25  SOLDERJUMPERNO  [SJ_2S-NO]  69.36,37.54 180 bottom
SJ26  JUMPER-SMT_2_NC_TRACE_NO-SILK  [SMT-JUMPER_2_NC_TRACE_NO-SILK]  33.56,73.2 180 top
SJ27  JUMPER-SMT_2_NC_TRACE_NO-SILK  [SMT-JUMPER_2_NC_TRACE_NO-SILK]  33.56,70.67 0 top
SJ32  JUMPER-SMT_2_NC_TRACE_NO-SILK  [SMT-JUMPER_2_NC_TRACE_NO-SILK]  33.6,63.01 180 top
SMA  5-1814400-1  [518144001]  109.09,3.56 180 top
STM32F303VET6  STM32F303VE  [TQFP100]  66,56.4 90 top
SV2  [MA06-1]  40.95,20.81 0 top
SV3  [MA03-1]  25.09,12.99 270 top
TB1  3.5MM_TB_X6  [3.5MM_X6]  1.4,58.8 0 top
TB2  3.5MM_TB_X6  [3.5MM_X6]  91.44,2.03 90 top
TB3  3.5MM_TB_X6  [3.5MM_X6]  130.18,67.39 180 top
TP1  TEST-POINTPOGO_PTH  [1X01_NO_SILK]  77.42,64.64 0 top
TP2  TEST-POINTPOGO_PTH  [1X01_NO_SILK]  56.41,66.48 0 top
TP7  TEST-POINTPOGO_PTH  [1X01_NO_SILK]  108.93,50.35 0 top
TP8  TEST-POINTPOGO_PTH  [1X01_NO_SILK]  53.7,64.46 0 top
TP9  TEST-POINTPOGO_PTH  [1X01_NO_SILK]  22.98,24.37 0 top
TP10  TEST-POINTPOGO_PTH  [1X01_NO_SILK]  93.35,67.73 0 top
TP11  TEST-POINTPOGO_PTH  [1X01_NO_SILK]  94.17,64.38 0 top
TP12  TEST-POINT3  [PAD.03X.03]  80.22,39.53 0 top
TP18  TEST-POINTPOGO_PTH  [1X01_NO_SILK]  88.84,74.63 0 top
TP19  TEST-POINTPOGO_PTH  [1X01_NO_SILK]  58.05,76.53 0 top
TP20  TEST-POINTPOGO_PTH  [1X01_NO_SILK]  104.53,70.61 0 top
U1  ESP32-WROOM-32D  [MODULE_ESP32-WROOM-32D]  58.63,32.65 180 bottom
U2  RFM69HCW/RFM95W  [RFMHCW_SMT]  102.8,19.4 0 bottom
U$2  BOOST_MODULEBOTHCONN  [BOOST]  83.42,30.58 270 top
USART1  UART1  [MA06-1]  17.83,6.57 0 top
USB-C  CSP-USC16-TR  [USB-C]  125.65,23.85 90 top
VT1  ADC-028-1-T  [DCJACK_2MM_SMT]  130,46.9 180 top

## Tracks (layer width: path | path; a pad name or v marks a point on that pad's centre or on a via)
3PH_BIAS  (2 unrouted)
  Top 0.305: LMV824.13 LMV824.14 | 123.05,77.6 LMV824.14 | 122.67,76.33 LMV824.13 | LMV824.3 119.03,75.06 | 119.03,75.06 arc45 120.83,75.81 | 120.83,75.81 121.28,76.26 arc-45 121.45,76.33 LMV824.13 | LMV824.5 119.75,72.52 | LMV824.10 119.75,72.52 | 119.75,72.52 119.75,73.69 | 119.75,73.69 arc-45 120.5,75.48 120.83,75.81 | 119.75,73.69 arc45 119.3,74.8 119.03,75.06 | LMV824.14 arc-45 123.35,77.9 127.9,77.9 arc-45 128.86,77.5 arc-45 129.31,76.41 129.31,75.78 arc-45 128.6,74.07 TB3.P$5
  Top 0.406: R53.2 114,57.34 116.71,57.34 arc-45 120.34,55.83 R34.2 | R34.2 122.55,52.92 | R34.2 120.34,56.14 arc45 119.6,57.93 118.93,58.6 | 118.93,58.6 118.93,58.85 arc-45 D1.K | D4.A 118.58,59.44 arc-45 118.93,58.6 | TB3.P$1 127.18,56.83 arc-45 126.44,55.04
  Bottom 0.305: TB3.P$1 128.54,60 arc45 129.28,61.8 129.28,67.42 | 129.28,67.42 129.28,69.73 arc45 128.71,71.11 TB3.P$5 | TB3.P$3 arc45 127.74,65.88 129.28,67.42
+3V3  (via drill 0.5)
  Top 0.254: R10.2 124.54,34.65 v124.54,34.41 | R33.1 72.38,38.48 v72.38,37.44 | C6.1 60,65.99 STM32F303VET6.50 | STM32F303VET6.28 71,66.06 | C8.1 | C5.1 56.33,49.16 57.57,50.4 STM32F303VET6.75 | v8.53,54.29 8.53,54.35 D21.K | v6.99,56.38 7.32,56.05 D34.K | R20.2 16.19,57.76 arc-45 16.2,57.76 | C3.1 72.83,46.84 v72.43,47.23 72,47.67 STM32F303VET6.100
  Top 0.305: C45.1 20.03,25.62 20.03,24.83 20.34,24.52 v20.88,24.52 19.85,24.52 R7.2 | RJ1.2 18.21,42.74 v18.27,42.67 | v18.27,42.67 18.28,42.7 arc-45 R1.2 C40.1 19.75,42.85 19.57,42.67 v18.27,42.67 | v10.7,27.15 RJ2.2 | BOOT_.4 130.46,15.03 | 130.46,15.03 BOOT_.3 | 130.46,15.03 128.82,15.03 BOOT.1 | D2.K 88.37,12.97 v89.03,13.62 | D3.K D3.K arc-45 13.44,58.1 R13.2 | D11.K 11.01,66.1 arc-45 v12.09,66.55
  Top 0.406: v58.95,67.58 59.46,67.07 C6.1 | v71.02,67.3 71,67.28 C8.1 71,66.06 | v55.16,49.38 55.86,49.38 C5.1 | FB5.2 120.1,17.59 v120.04,17.65
  Top 0.5: 16.2,57.76 17.89,56.06 arc-45 18.47,54.66 OLED.3
  Top 0.508: R13.2 15.87,57.8 R20.2
  +3V3 0.406: v107.33,38.37 arc-45 106.71,38.15 v105.85,38.22
  +3V3 0.5: v47.26,29.9 46.95,29.59 v46.95,27.58
  Bottom 0.305: 16.54,28.95 MICROSD.PIN4 19.51,28.95 v19.69,28.76 | 16.54,28.95 16.48,28.89 | 16.54,28.95 15.01,28.95 12.5,28.95 v10.7,27.15
  Bottom 0.406: SJ23.2 47.21,28.67 47.21,27.84 v46.95,27.58 | v42.62,30.33 41.59,30.33 v41.22,29.96 41.08,29.82 C26.1 41.27,28.83 C25.1 | v42.62,30.33 43.85,30.33 v43.89,30.29 44.89,30.29 | 44.89,30.29 v44.93,30.25 | 44.89,30.29 44.89,29.12 C24.1 C25.1 | C25.1 42.62,29.31 v42.62,30.33 | C25.1 | C53.1 16.16,23.23 15.01,24.39 15.01,28.95
  Bottom 0.5: SJ23.2 47.25,29.89 arc-45 v47.26,29.9
  other vias: 106.71,37.49 106.2,36.01 105.72,37.01 109.29,36.11
  pour +3V3: 138.44,41.4 138.44,0.36 127.28,-10.79 2.92,-10.79 -9.34,1.47 -9.34,71.35 -1.35,79.35 8.87,79.35 50.31,53.1 60.05,59.38 57.69,68.67 60.54,68.87 61.91,66.74 62.32,62.34 63.54,60.55 66.96,60.52 69.56,63.12 69.56,68.15 72.54,68.15 72.54,55.6 76.33,51.81 76.33,47.32 76.23,47.22 76.23,46.2 79.09,43.34 92.82,43.34 103.9,53.68 105.5,40.06 106.72,39.7 108.56,37.86 133.4,37.86 134.79,39.25
  pour Top: 111.95,38.76 105.25,38.76 105.25,35.56 105.25,35.37 111.9,35.37
+3V3ANA  (via drill 0.5)
  Top 0.254: STM32F303VET6.22 75.67,60.9 77.3,62.52 R22.1 | C13.1 80.37,63.21
  Top 0.305: TP1.1 arc-45 77.51,64.43 | v115.95,73.79 LMV824.4 arc-90 117.23,73.81 v118.53,73.81
  Top 0.356: v37.28,82.84 37.28,84.24 arc-45 LMV3.4 37.29,85.54 arc45 v37.22,85.7 | v93.83,82.88 93.83,84.19 arc-45 LMV1.4 93.88,85.69 arc45 v93.82,85.83
  Top 0.406: C13.1 78.44,63.61 R22.1 77.42,62.59 TP1.1 77.58,64.8 v77.58,66.15 78.06,66.63 v78.45,66.63 78.97,66.12 C17.1 | v65.94,82.93 arc45 65.95,82.96 LMV2.4 65.95,85.59 arc45 v65.92,85.66 | D10.K arc-45 33.85,96.78 v33.85,97.74 | D8.K 72.07,97.72 arc45 v72.06,97.74 | D6.K 110.01,97.61 arc-45 v110.02,97.63 | D4.K arc45 116.82,59.59 v115.45,59.59 | v99.38,64.89 99.38,64.39 | 99.38,64.39 v99.38,63.89 v99.37,63.88 | FB6.2 98.22,64.39 99.38,64.39
  Top 0.508: C43.1 108.42,46.31 | C17.1 80.75,65.97 C13.1
  other vias: 108.68,48.78 109.92,46.78 109.91,48.87 109.74,47.74 108.56,47.83
  pour +3V3 (rank 6): 33.62,88.02 34.23,77.92 43.29,63.53 48.01,63.21 52.94,70.91 75.63,70.44 75.5,63.84 76.83,62.5 80.29,62.95 107.02,59.53 107.48,44.96 107.59,41.56 123.19,74.19 125.39,88.9
  pour Top: 111.84,45.2 111.84,51.47 107.97,51.47 107.97,45.16 109.95,45.16
  pour Top: 78.32,66.95 80.76,66.95 80.83,66.88 80.83,63.46 80.57,63.2 78.86,63.2 78.04,62.38 76.8,62.38 76.69,62.49 76.69,65.21 78.36,66.87 78.49,66.87
  pour +3V3: 107.85,100.2 110.36,100.2 arc-90 112.94,97.63 112.94,85.98 arc-90 109.42,82.46 arc-90 105.34,86.54 105.34,98.35 arc-90 107.06,100.07
  pour +3V3: 70.05,100.01 72.56,100.01 arc-90 75.13,97.43 75.13,85.78 arc-90 71.62,82.26 arc-90 67.54,86.34 67.54,98.15 arc-90 69.26,99.87
  pour +3V3: 32.67,100.4 35.18,100.4 arc-90 37.76,97.82 37.76,86.18 arc-90 34.24,82.66 arc-90 30.16,86.74 30.16,98.55 arc-90 31.88,100.26
+5V  (via drill 0.5)
  Top 0.254: 92.03,35.8 92.03,38.43 v91.76,38.69 | D14.A 90.88,43.08 91.07,43.27 v91.55,43.27
  Top 0.305: RJ2.7 17.47,20.79 19.42,18.84 C47.1 | C42.1 18.36,36.39 RJ1.7 | 28.97,36.22 19.84,36.22 19.25,35.62 | 20.19,17.75 24.51,17.75 28.8,22.05 28.8,26
  Top 0.35: PCB2.P$44 24.43,73.18 arc90 C28.1 21.9,72.65 arc-90 C18.1 C27.1
  Top 0.356: 20.19,17.64 arc45 20.19,17.64 19.87,17.32 16.56,14.01 16.56,11.96 USART1.3
  Top 0.406: 20.19,17.64 20.19,17.75 | 19.95,18.31 20.25,18.01 20.25,18.82 C47.1 | 19.95,18.31 17.47,20.79 | 19.87,17.32 19.95,17.4 19.95,18.31 | C51.1 16.56,11.96 | 120.45,31.01 120.46,31.02
  Top 0.5: PCB2.P$42 PCB2.P$44 | 27.02,73.18 arc-90 28.97,71.23 28.97,36.22 28.97,26 | 28.8,26 28.97,26 | 28.97,26 32.7,26 arc90 33.9,27.2 33.9,29.54 | 73.64,35.8 92.03,35.8 101.36,35.8
  Top 0.508: C12.1 118.53,26.87 119.74,26.87 FB1.2 118.73,27.88 arc45 116.94,28.62 111.11,28.62 arc-45 109.31,29.37 103.62,35.06 | 101.36,35.8 101.83,35.8 arc-45 103.62,35.06 | 33.9,29.54 arc-45 34.51,31.01 36.94,33.44 67.02,33.44 arc45 68.82,34.19 69.69,35.06 arc-45 71.48,35.8 73.64,35.8 | FB8.2 119.57,46.78 121.19,45.16 121.19,39.31 119.57,37.7 | PCB2.P$44 27.02,73.18 | SV2.3 39.67,22.96 C10.1 39.05,23.32 36.37,26 32.7,26 | C42.1 19.2,35.58 19.25,35.62 | C4.1 115.81,27.24 C15.1 | 103.62,35.06 101.04,37.63 JP2.14
  Top 0.813: C15.1 118.43,26.8 C12.1 | FB1.2 120.46,31.02 120.46,36.81 119.57,37.7 FB9.2
  Bottom 0.254: v91.55,43.27 91.55,38.9 v91.76,38.69
+5V_A
  Top 0.254: 117.48,46.74 FB8.1 | C39.1 117.48,46 117.48,46.74 | 117.48,46.74 117.48,46.92
  Top 0.508: MCP1825(ANALOG).1 117.48,46.92 | FB8.1 117.52,45.96 C39.1
+5V_BATT
  Top 0.305: D14.K 88.1,42.36 C52.1 87.88,42.34 IC_VBAT.3
+5V_D
  Top 0.813: FB9.1 117.02,37.16 MCP1825.1 118.2,34.8 C21.1
+5V_USB  (via drill 0.5)
  Top 0.406: 123.54,13.12 124.39,13.97 | 124.39,13.97 124.39,17.25 125.38,18.24 127.15,18.24 127.69,18.78 127.69,23.15 127.42,23.42 | 124.39,13.97 123.81,13.97 U$2.IN+
  Top 0.508: USB-C.A4/B9 125.84,21.45 arc45 126.77,21.83 arc45 127.42,23.42 127.42,24.35 arc45 126.83,25.77 arc45 125.68,26.25 USB-C.B4/A9 122.38,26.25 arc45 FB1.1 arc-45 122.53,25.25 C34.1 arc-45 122.44,24.33 D40.K | U$2.IN+ 123.09,13.25 | 118.76,7.66 C59.1 | C59.1 116.67,7.64 C58.1 | C59.1 arc-90 118.76,7.66 | 118.76,7.66 119.81,7.66 | 119.81,7.66 C60.1 | v117.86,10.71 119.81,10.71 | 119.81,10.71 122.75,10.71 arc-90 U$2.IN+1 | 119.81,10.71 119.81,7.66
  Top 1.27: U$2.IN+ U$2.IN+1
  Bottom 0.406: 100.19,6.36 104.53,10.71 v117.86,10.71
  Bottom 0.508: 100.19,6.36 TB2.P$6
+24V
  Top 0.178: R17.2 86.3,15.68 86.9,15.08
  Top 0.3: R9.2 R11.2 86.9,15.08
  Top 0.305: TB2.P$1 82.85,5.03 83.42,5.61 U$2.OUT+1 | U$2.OUT+ 84.43,14.1 R17.2
  Top 1.27: U$2.OUT+ U$2.OUT+1
_AC1  (2 unrouted)
  Top 0.406: 115.58,52.66 arc-45 R43.2 arc45 115.58,52.66 | 115.58,52.66 116.86,53.94 | 117.04,54.62 R34.1 arc-45 117.19,54.28 116.86,53.94 | 123.8,45.95 arc45 123.06,47.75 116.86,53.94 | 115.58,52.66
AC1
  Top 0.305: 113.93,53.74 R43.1 R53.1 | R53.1 113.76,55.75 | R29.1 113.66,55.75 arc45 R53.1
  Top 0.406: R43.1 arc-45 R43.1
AC1_T  (via drill 0.5)
  Top 0.305: R39.1 118.32,63.59 arc-45 115.01,64.96 112.92,67.05 R25.1 arc-45 112.38,71.84 v112.3,71.75 | LMV824.1 115.9,77.6 arc45 v115.82,77.57
  Bottom 0.305: v112.3,71.75 112.3,74.14 115.73,77.57 v115.82,77.57
AC2_T  (via drill 0.5)
  Top 0.305: R26.1 arc-45 113.2,74.89 113.8,74.28 arc-45 113.96,73.9 113.96,68.05 115.78,66.23 arc45 116.92,65.76 118.83,65.76 | 118.83,65.76 arc-45 R40.1 | LMV824.7 117.21,69.2 arc-45 v117.1,68.95 | v117.23,66.49 117.36,66.36 arc45 118.83,65.76
  Bottom 0.305: v117.1,68.95 arc-45 117.23,68.63 v117.23,66.49
AC3_T
  Top 0.305: R27.1 110.88,77.94 arc-45 112.68,77.19 114.15,75.72 arc-45 114.9,73.92 114.9,68.69 115.64,67.95 arc45 116.76,67.48 118.15,67.48 arc45 R41.2 120.37,69.24 arc-45 122.17,69.98 LMV824.8
ADC_2_RJ45IN  (via drill 0.5)
  Top 0.178: STM32F303VET6.61 59.71,57.4 59.98,57.13 59.98,56.44 60.53,55.88 60.53,54.45 v60.43,54.34 | v48.57,50.84 48.19,51.21 45.93,51.21
  Top 0.203: 45.93,51.21 44.16,51.21 41.77,48.83 38.3,48.83 35.42,45.95 v35.42,45.3 | v23.47,40.06 23.36,39.95 v23.36,37.38 | v10.58,19.52 RJ2.8
  Bottom 0.178: v60.43,54.34 60.23,54.15 57.48,54.15 55.17,51.84 48.91,51.84 48.57,51.5 v48.57,50.84
  Bottom 0.203: v35.42,45.3 34.31,44.19 34.31,42.28 33.6,41.57 24.97,41.57 v23.47,40.06 | v23.36,37.38 22.63,36.65 22.63,35.07 21.9,34.34 17.09,34.34 13.28,30.53 11.86,30.53 9.07,27.73 9.07,21.03 v10.58,19.52
ADC_RJ45IN  (via drill 0.5)
  Top 0.178: v61.29,52.37 61.29,56.17 61.83,56.71 61.83,58.33 59.23,60.93 | v49.51,51.23 48.92,51.81 46.12,51.81
  Top 0.203: 46.12,51.81 43.79,51.81 41.43,49.46 37.98,49.46 34.47,45.95 v34.47,45.35 | v24.45,43.9 23.86,43.3 v23.86,41.84 | v14.42,34.12 14.42,35.06 RJ1.8 | STM32F303VET6.54 59.23,60.93
  Bottom 0.178: v61.29,52.37 61.29,52.23 60.39,51.33 49.61,51.33 v49.51,51.23
  Bottom 0.203: v34.47,45.35 33.01,43.9 v24.45,43.9 | v23.86,41.84 16.13,34.12 v14.42,34.12
AGND  (via drill 0.5)
  Top 0.254: 60.01,72.95 CF6.1 | 50.16,73 CF8.1
  Top 0.305: v121.35,73.81 122.62,73.81 arc-90 LMV824.11 124.03,73.79 arc-90 v124.05,73.77
  Top 0.406: v65.95,80.15 arc45 v65.95,80.14 LMV2.11 65.95,77.6 arc-45 v65.94,77.58 | D9.A v32.34,97.64 arc45 v32.34,97.65 | D7.A v70.44,97.71 arc-45 v70.45,97.71 | D5.A 108.31,97.42 arc-45 v108.34,97.48
  Top 0.508: FB3.2 112.92,22.62 arc45 v112.87,22.6 112.87,23.25 | FB3.2 113.31,23.52 arc45 v112.96,23.66 | FB3.2 arc-45 113.98,23.16 | 113.98,23.16 v113.98,23.95 | 112.87,23.25 112.87,23.47 arc-45 v112.96,23.66 | v112.96,23.66 113.3,23.66 arc45 v113.98,23.95 | v113.98,23.95 113.64,23.95 arc45 v112.96,23.66 | v112.96,23.66 arc-45 113.85,23.3 113.98,23.16 | FB3.2 arc-45 113.01,23.11 112.87,23.25
  other vias: 5.13,96.32 15.8,101.58 28.74,101.92 41.16,101.77 54.03,101.89 67.01,102.45 79.38,102.26 91.95,101.63 104.62,101.67 117.4,101.74 74.08,66.88 71.69,59.69 70.49,59.82 83.92,66.9 81.9,67.17 84.76,59.38 130.2,49.11 116.46,40.66 113.56,42.7 110.83,40.59 119.81,40.63 120.26,41.58 118.81,41.16 117.01,42.92 118.73,49.12 120.25,47.54 113.47,44.68 113.61,48.82 114.65,48.82 112.57,48.79 114.57,44.66 112.34,44.54 108.42,42.45 110.08,44.06 110.13,42.26 125.11,88.62 113.22,78.67 111.07,83.29 107.17,83.39 82.64,83.11 76.93,81.49 9.43,83.41 65.54,62.55 58.72,72.92 53.7,72.93 48.69,72.97 43.61,72.97 63.68,72.93 68.61,73.01 73.62,72.93 78.43,72.97 83.6,72.97 77.8,59.6 82.16,60.01 83.59,64.76 122.18,43.21 68.26,66.84 128.07,54.51 90.98,74.68 39.77,68.28 59.84,59.24 61.25,60.1 14.42,94.51 26.9,94.26 38.34,98.05 54.74,94.68 67.36,94.49 80.05,94.22 90.43,94.17 103.01,94.39 115.6,94.42 9.66,90.88 110.67,60.93 122.88,80.91 100.82,75.07 103.88,73.21 100.52,70.96 109.18,74.24 106.61,76.75 102.6,78.64 120.43,71.31 119.36,76.67 111.82,69.35 130.8,55.08 129.77,96.33 127.29,67.43 40.44,75.89 40.8,73.28 76.2,59.56 115.44,42.75 111.26,42.67 127.04,74.44 112.42,64.11 100.32,68.97 122.75,68.92 37.21,80.28 37.18,77.42 93.81,80.41 93.72,77.47 51.81,66 49.39,57.54 47.08,57.95 51.36,57.8 97.33,68.91 74.14,82.07 73.42,75.59 78.3,74.71 79.62,78.11 68.39,75.65 59.66,82.18 56.48,78.53 45.22,82.5 50.46,78.43 36.41,86.82 31.09,86.93 23.42,85.13 20.97,85.74 81.87,86.81 70.29,89.55 68.35,87.19 69.14,85.6 98.26,80.71 101.06,80.05 95.01,59.8 96.69,59.71 101.96,59.94
  pour GND (rank 6): 8.15,121.68 116.38,121.68 arc-90 139.77,98.29 139.77,47.44 arc-90 133.1,40 112.72,40 arc-90 107.61,42.56 107.61,63.96 arc90 105.93,67.94 97.95,67.94 arc90 95.23,66.55 95.23,60.48 arc-90 93.56,58.8 55.72,58.62 arc-90 44.45,58.75 44.33,63.86 arc90 43,66.7 38.6,66.7 arc-90 36.44,68.85 36.44,73.7 arc90 32.61,77.53 13.6,77.53 arc-90 7.61,83.51 7.61,91.88 arc90 6.3,93.19 3.11,93.19 arc-90 -3.2,99.5 -3.2,117.5 arc-90 4.02,124.71
  pour Top (isolate 0.203, rank 6): -7.06,121.68 116.38,121.68 arc-90 139.77,98.29 139.77,47.44 arc-90 132.36,40.04 110.51,40.04 arc-90 107.95,42.59 107.95,56.68 arc90 105.42,59.22 95.29,59.25 54.48,59.14 arc-90 43.87,58.14 arc90 37.39,66.82 arc-90 36.44,68.85 36.44,73.7 arc90 32.61,77.53 13.6,77.53 arc-90 7.61,83.51 7.61,86.58 arc90 -1.76,95.95 -1.76,116.38 arc-90
  pour Bottom (isolate 0.203, rank 6): 8.15,121.68 116.38,121.68 arc-90 139.77,98.29 139.77,47.44 arc-90 132.36,40.04 110.51,40.04 arc-90 107.95,42.59 107.95,56.72 arc90 105.41,59.26 95.29,59.26 56.13,59.23 53.91,58.32 arc-90 44.83,57.66 44.34,61.17 arc90 39.22,66.39 arc-90 36.44,68.85 36.44,73.7 arc90 32.61,77.53 13.6,77.53 arc-90 7.61,83.51 7.61,91.88 arc90 6.3,93.19 3.11,93.19 arc-90 -3.2,99.5 -3.2,117.5 arc-90 4.02,124.71
  pour GND (isolate 0.305, rank 3): 109.99,46.62 arc-90 110.13,46.77 120.12,46.77 arc-90 121.16,45.72 121.16,39.95 121.16,38.29 arc-90 119.88,37.02 arc90 118.13,35.26 118.13,32.76 118.13,24.57 arc-90 115.05,21.49 112.45,21.49 arc-90 110.18,23.76 110.18,35.36 arc90 109.09,36.45 arc-90 108.38,37.16 108.38,45.91
ANT
  Top 0.305: R6.2 108.96,9.81 arc-45 JP6.2
  Top 0.406: C48.1 109.1,10.52
  Top 0.66: JP6.2 108.65,10.07 109.1,10.52
  Top 1.524: 109.1,10.52 109.1,11.35 arc-90 RFM69HCW.8
ANT_LORA  (via drill 0.5)
  Top 0.66: JP6.1 106.79,11.15 v105.54,12.4 v104.25,12.4
  Bottom 0.66: v105.54,12.4 U2.1P
BIAS123  (via drill 0.5)
  Top 0.356: RB11.2 122.91,90.49 arc-45 123.66,88.7 123.66,88 arc-45 123.13,86.72 119.7,83.29 arc-45 117.21,82.26 103.92,82.26 arc45 100.76,80.96 | 100.76,80.96 98.9,79.09 arc-45 98.4,78.89 LMV1.14 | RB22.2 arc-45 110.21,90.59 v110.21,89.29 | v106.58,84.59 105.45,84.59 arc45 103.66,83.85 100.76,80.96 | RB33.2 arc-45 97.52,90.5 97.52,87.52 arc-45 97.47,87.39 95.69,85.61 arc45 LMV1.3
  Top 0.406: LMV1.5 92.61,81.72 | 92.61,81.72 LMV1.10 | LMV1.3 95.15,81.72 | 95.15,81.72 92.61,81.72 | 95.15,81.72 96.42,81.72 LMV1.13 LMV1.14 | D5.K 109.2,94.94 | 109.2,94.94 109.97,94.94 arc-45 D6.A | 109.2,94.94 109.2,92.71 arc45 109.94,90.92 RB22.2
  Bottom 0.356: v110.21,89.29 110.21,86.74 arc-45 109.95,86.11 109.17,85.34 arc-45 107.38,84.59 v106.58,84.59
BIAS456  (via drill 0.5)
  Top 0.254: 75.35,85.67 73.19,85.67 arc-45 71.47,86.39
  Top 0.356: v65.08,81.24 arc-45 65.16,81.44 65.36,81.63
  Top 0.406: 67.22,81.63 LMV2.3 67.22,85.44 arc-45 67.3,85.63 67.32,85.64 arc-45 69.11,86.39 71.47,86.39 arc45 71.91,87.47 71.91,90.21 arc-45 RB55.2 72,91.23 arc-45 71.26,93.03 71.26,95.14 | 64.68,81.63 LMV2.5 | 67.22,81.63 65.47,81.63 v65.08,81.24 | 65.36,81.63 64.68,81.63 | LMV2.10 64.68,81.63 | 67.22,81.63 68.49,81.63 LMV2.13 LMV2.14 | RB66.2 60.21,90.7 arc-45 v61.53,90.15 | 67.22,81.63 67.05,81.63 v67.05,81.23 | RB44.2 arc-45 84.92,90.24 84.92,88.27 arc-45 84.56,87.4 82.84,85.67 75.35,85.67 | D7.K 71.26,95.14 | 71.26,95.14 72.06,95.14 arc45 D8.A
  Bottom 0.406: v61.53,90.15 64.63,87.06 64.63,81.7 v65.08,81.24 | 67.28,90.53 arc45 67.22,90.36 67.22,81.06 v67.05,81.23
BIAS789  (via drill 0.5)
  Top 0.305: LMV3.5 arc45 35.29,86.03 34.52,86.79 arc-45 33.78,88.58 33.78,90.28 arc45 RB88.2 | RB77.2 arc-45 46.61,89.58 46.61,87.78 arc-45 46.53,87.59 45.97,87.03 arc-45 45.94,87.02 v43.13,87.02 | 38.56,84.5 LMV3.3
  Top 0.406: LMV3.5 36.02,81.5 | 36.02,81.5 LMV3.10 | 36.02,81.5 38.56,81.5 | 38.56,81.5 LMV3.3 | 38.56,81.5 39.83,81.5 LMV3.13 LMV3.14 | RB99.2 22.2,90.97 arc-45 23.99,90.23 v24.07,90.15 | v35.12,81.52 35.99,81.52 arc-45 36.02,81.5 | D9.K arc-45 D9.K 33.1,95.15 | 33.1,95.15 D10.A | 33.1,95.15 33.1,91.7 arc45 RB88.2
  Bottom 0.406: v24.07,90.15 25.2,89.03 arc-45 25.94,87.23 25.94,85.86 29.54,82.26 arc45 31.33,81.52 v35.12,81.52 arc45 35.57,82.59 35.57,83.54 35.64,83.61 arc-45 37.44,84.36 39.42,84.36 arc45 41.22,85.1 v43.13,87.02
BIAS_INPUT  (via drill 0.5)
  Top 0.254: R56.2 arc45 49.32,61.35 | 49.32,61.35 49.32,61.68 49.32,62.17 R55.1 | C20.1 50.08,61.67 arc45 49.32,61.35
  Top 0.305: R55.1 arc-45 R56.2 R56.2 arc45 49.05,61.36
  Top 0.406: LMV3.12 38.56,78.06 39.09,77.53 42.45,77.53 v42.61,77.69 44.31,79.39 arc-45 44.87,79.62 C35.1 47.39,79.62 arc45 v49.09,80.32 | v67.24,77.05 67.22,77.07 LMV2.12 | LMV1.12 arc45 95.1,78.76 v95.1,77.07 98.33,77.07 arc45 100.13,77.82 100.51,78.19 | 119.86,79.91 arc45 118.06,80.65 103.74,80.65 arc45 102.41,80.1 100.51,78.19 | 119.86,79.91 120.59,79.17 120.59,77.92 arc-45 v120.57,77.88 | v121.24,74.86 arc-45 121.74,75.06 LMV824.12 | C50.1 73.67,78.31 arc45 v73.14,77.05 | C36.1 arc-45 100.48,78.17 100.51,78.19 | C56.1 arc-45 119.86,80.96 119.86,79.91
  Top 0.508: v46.78,62.3 48.99,62.3 arc-45 49.32,62.17 | C20.1 49.36,61.67 arc-45 49.32,61.68
  Bottom 0.406: v95.1,77.07 arc-45 93.87,76.56 88.74,76.56 arc45 87.44,76.02 86.64,75.23 arc-45 84.84,74.48 80.3,74.48 77.73,77.05 v73.14,77.05 v67.24,77.05 66.64,76.45 62.06,76.45 58.64,79.86 arc45 57.53,80.32 v49.09,80.32 | v120.57,77.88 120.57,76.46 arc45 v121.24,74.86
  Bottom 0.508: v46.78,62.3 43.36,65.73 arc-45 42.61,67.53 v42.61,77.69
BOOT0_RPI
  Top 0.178: PCB2.P$47 32.02,68.1 32.43,67.69 32.43,67.64 J1.2
BOOT_STM  (via drill 0.5)
  Top 0.178: R2.1 69.42,39.2 v68.73,39.2 | v71.05,34.03 71.05,33.35 72.63,31.76 75.47,31.76 76.45,32.75 v80.82,32.75
  Top 0.203: R2.1 69.73,42.6 69,43.34 STM32F303VET6.94 69,51.55 v66.16,54.39 | v35.27,65.31 34.62,65.96 J1.1 | v105.22,19.88 105.22,21.7 v105.45,21.93 | BOOT.2 128.35,12.01 126.53,12.01
  Top 0.305: 126.45,9.71 BOOT_.1 126.53,10.64 126.53,12.01 126.53,16.28 BOOT_.2
  Bottom 0.178: v68.73,39.2 69.63,39.2 70.37,38.46 70.37,34.71 v71.05,34.03 | v80.82,32.75 80.82,29.89 82.25,28.46 87.69,28.46 91.67,24.48 91.67,15.07 93.25,13.49 99.44,13.49 105.15,19.21
  Bottom 0.203: v35.27,65.31 35.88,65.31 41.56,59.63 41.56,56.57 44.61,53.52 53.84,53.52 56.33,56.01 59.68,56.01 61.24,54.45 66.1,54.45 v66.16,54.39 | 105.15,19.21 105.15,19.81 v105.22,19.88 | v105.45,21.93 108.85,25.33 114.86,25.33 115.7,24.48 115.7,21.66 118.39,18.98 118.39,12.85 arc45 118.76,11.95 121.25,9.46 arc45 123.05,8.71 124.67,8.71 arc90 127.22,11.26 BOOT.2
BUTTON1  (via drill 0.5)
  Top 0.178: PCB2.P$53 31.75,60.48 33.02,60.48 SJ3.1 33.16,61.44 34,61.44 34.97,62.41 34.97,63.61 34.41,64.18 30.32,64.18 30.01,64.48 | 16.54,73.86 v17.24,73.86
  Top 0.203: S1.2 2.74,73.86 16.54,73.86 | v30.01,74.65 30.01,64.48 | 31.29,60.48 PCB2.P$53
  Bottom 0.178: v17.24,73.86 18.17,74.79 arc-45 19.96,75.53 28.08,75.53 arc-45 29.88,74.79 v30.01,74.65
BUTTON1_STM  (via drill 0.5)
  Top 0.178: STM32F303VET6.53 v56.96,61.4 v56.96,61.39 | v40.09,63.27 39.62,63.74 36.51,63.74 35.46,62.69 35.46,61.88 SJ3.2
  Bottom 0.178: v56.96,61.39 55.81,60.23 55.81,57.97 51.71,53.87 | v40.09,63.27 40.2,63.16 40.2,61.85 41.65,60.4
  Bottom 0.203: 41.65,60.4 41.93,60.11 41.93,56.94 45,53.87 51.71,53.87
CAN_RX  (via drill 0.5)
  Top 0.178: 75.61,41.99 80.09,37.51 80.09,36.98
  Top 0.203: v75.73,43.29 75.61,43.17 75.61,41.99 | 80.09,36.98 80.43,36.63 88.31,36.63 96.92,45.25 JP2.7 | v63,51.39 62.5,50.89 STM32F303VET6.81
  Bottom 0.203: v75.73,43.29 75.65,43.29 74.27,44.67 74.27,47.28 70.56,50.99 63.39,50.99 v63,51.39
CAN_TX  (via drill 0.5)
  Top 0.203: v76.18,44.31 76.38,44.11 76.38,41.71 79.53,38.55 89.33,38.55 98.27,47.48 98.27,47.77 JP2.5
  Top 0.254: STM32F303VET6.82 63,50.32 v64.31,51.69
  Bottom 0.203: v76.18,44.31 76.09,44.4 75.14,44.4 74.71,44.83 74.71,47.59 70.89,51.41 64.6,51.41 v64.31,51.69
CT1_ADC
  Top 0.254: RF1.2 86.73,72.97 arc90 CF1.2 | CF1.2 86.75,72.35 arc-90 84.41,70.01 70.24,70.01 arc90 67.5,67.27 STM32F303VET6.35 | TP18.1 87.16,72.95 CF1.2
  Top 0.305: TP18.1 87.29,74.63 RF1.2
CT1_OUT  (via drill 0.5)
  Top 0.356: R60.1 arc45 98.89,84.31 LMV1.1 97.69,83.15 arc-45 v97.59,82.91 | v83.7,76.29 84.88,75.11 arc-45 RF1.1
  Bottom 0.356: v97.59,82.91 97.59,82.85 arc-45 96.85,81.05 95.26,79.46 arc-45 94.36,79.09 89.88,79.09 arc45 88.08,78.35 87.43,77.69 86.15,77.69 arc45 84.35,76.95 v83.7,76.29
CT2_ADC
  Top 0.254: RF2.2 81.76,72.97 arc90 CF2.2 arc-90 79.38,70.55 69.63,70.55 arc90 67,67.92 STM32F303VET6.36
CT2_OUT  (via drill 0.5)
  Top 0.356: LMV1.7 89.91,84.15 arc-45 88.11,83.4 R61.1 arc45 86.77,83.07 v85.57,81.87 | RF2.1 83.68,78.74 arc-45 v84.21,78.96
  Bottom 0.356: v84.21,78.96 84.21,79.46 arc-45 84.95,81.26 v85.57,81.87
CT3_ADC
  Top 0.254: RF3.2 arc-90 76.81,75.18 CF3.2 76.81,72.94 arc-90 74.97,71.11 69.25,71.11 arc90 66,67.86 STM32F303VET6.38
CT3_OUT
  Top 0.356: LMV1.8 89.38,79.58 arc45 87.58,80.32 R62.2 80.08,80.32 arc45 78.29,79.58 75.34,76.63 arc45 74.99,75.78 RF3.1
CT4_ADC
  Top 0.254: RF4.2 CF4.2 arc90 CF4.2 arc-90 70.58,71.69 68.62,71.69 arc90 65.5,68.57 STM32F303VET6.39
CT4_OUT
  Top 0.406: RF4.1 70.04,75.47 arc-45 70.72,77.13 70.72,81.92 arc45 70.55,82.33 70.51,82.38 arc-45 69.76,84.18 | 69.76,84.18 LMV2.1 | R63.1 arc-45 72.75,84.18 69.76,84.18
CT5_ADC
  Top 0.254: RF5.2 66.89,72.92 CF5.2 66.95,72.86 66.95,72.15 arc90 65,70.2 STM32F303VET6.40
CT5_OUT
  Top 0.254: 63.52,76.5 arc-45 62.78,78.3 62.78,80.17 | 62.78,81.59 arc45 62.21,82.95 arc-45 62.14,83.12 LMV2.7
  Top 0.406: R64.1 arc-45 61.28,85.13 LMV2.7 arc-45 62.21,84.1 62.21,82.95 arc45 62.78,81.59 62.78,80.17 | RF5.1 63.52,76.5
CT6_ADC
  Top 0.254: RF6.2 CF6.2 61.89,71.29 arc90 62.31,70.86 arc-90 64.5,68.67 STM32F303VET6.41
CT6_OUT
  Top 0.406: RF6.1 60.04,75.7 arc-45 60.79,77.49 62,78.7 | 62,78.7 LMV2.8 | R65.2 61.93,78.67 arc45 62,78.7
CT7
  Top 0.254: CF7.2 RF7.2 56.84,75.31 TP19.1 | CF7.2 56.91,72.56 | CF7.2 56.91,72.27 arc90 59.09,70.09 61.46,70.09 arc-90 64,67.55 STM32F303VET6.42
CT7_OUT
  Top 0.356: RF7.1 54.97,75.14 | 45.55,83.69 45.42,83.82 arc45 R66.1
  Top 0.406: LMV3.1 44.33,84.26 arc-45 R66.1 arc-45 45.88,84.03 52.05,84.03 arc-45 53.84,83.28 55,82.13 arc-45 55.35,81.26 55.35,75.51 arc-45 RF7.1
CT8
  Top 0.254: RF8.2 CF8.2 51.94,71.9 arc90 54.48,69.36 60.96,69.36 arc-90 63.5,66.82 STM32F303VET6.43
CT8_OUT
  Top 0.254: 35.01,80.56 arc-45 35.38,79.67 35.38,77.87 arc45 35.62,77.3 35.75,77.16 | 37.55,76.42 37.65,76.42
  Top 0.356: R67.1 30.73,83.43 arc45 31.48,83.74 arc-45 32.74,84.26 LMV3.7 33.48,83.15 arc45 34.22,81.35 35.01,80.56 | 35.75,77.16 arc45 37.55,76.42 | 37.65,76.42 arc45 38.28,76.68 48.31,76.68 arc-45 48.67,76.53 RF8.1
CT9
  Top 0.254: RF9.2 CF9.2 46.97,71.33 arc90 49.51,68.79 60.46,68.79 arc-90 63,66.25 STM32F303VET6.44
CT9_OUT
  Top 0.356: R68.2 30.79,80.48 arc-45 32.58,79.73 LMV3.8 arc45 33.9,77.82 35.92,75.8 arc45 37.71,75.06 RF9.1
CT_IN1
  Top 0.356: CT1.P$2 112.9,90.71 arc45 113.64,88.91 113.96,88.6 arc45 115.46,87.98 | 115.46,87.98 RB1.1 115.64,88.19 | RB1_.1 115.64,88.19 | 115.64,88.19 115.64,88.89 | LMV1.2 96.42,84.44 arc-45 96.81,85.39 arc-45 97.46,85.66 R60.2 112.08,85.66 arc45 113.88,86.4 115.46,87.98
CT_IN2  (via drill 0.5)
  Top 0.356: CT2.P$2 100.2,91.08 102.86,88.43 102.86,88.19 102.81,88.19 | 102.45,87.8 RB2.1 102.81,88.19 | RB2_.1 102.81,88.19 | R61.2 arc-45 88.67,85.76 90.07,85.76 arc-45 90.89,85.42 91,85.32 arc-45 91.34,84.49 LMV1.6 91.34,85.51 arc-45 v91.5,85.89
  Bottom 0.356: RB2_.1 97.98,87.44 arc-45 96.18,86.7 93.36,86.7 arc45 91.56,85.95 v91.5,85.89
CT_IN3  (via drill 0.5)
  Top 0.356: R62.1 87.83,78.14 arc45 89.62,77.39 90.39,77.39 arc45 90.91,77.61 arc45 91.34,78.65 LMV1.9 91.34,80.17 arc-45 v91.21,80.48 | CT3.P$2 87.5,92.06 arc45 88.24,90.26 RB3.1 arc45 90.29,88.19 RB3_.1
  Bottom 0.356: RB3_.1 88.68,85.72 arc-45 89.43,83.92 89.43,82.27 v91.21,80.48
CT_IN4  (via drill 0.5)
  Top 0.356: 77.26,87.84 RB4.1
  Top 0.406: 73.46,88.17 RB4.1 75.47,90.28 arc-45 74.73,92.08 74.73,94.73 arc-45 CT4.P$2 | 73.46,88.17 arc-45 RB4_.1 | v68.53,82.74 68.53,84.17 arc45 LMV2.2 | R63.2 74.04,86.76 arc45 73.46,88.17
  Bottom 0.406: RB4_.1 68.98,83.82 arc45 v68.53,82.74
CT_IN5  (via drill 0.5)
  Top 0.254: CT5.P$2 62.52,94.47
  Top 0.356: RB5_.1 64.81,88.18 RB5.1 | 64.54,87.81 RB5.1 | RB5.1 64.16,87.42 arc45 63.41,85.63 LMV2.6
  Top 0.406: R64.2 arc-45 60.36,83.61 61.22,82.75 v61.38,82.75 | v63.31,82.67 arc-45 63.41,82.92 LMV2.6 | CT5.P$2 62.1,92.37 arc45 62.84,90.58 64.51,88.91 arc-45 64.81,88.18
  Bottom 0.406: v61.38,82.75 61.41,82.73 63.25,82.73 v63.31,82.67
CT_IN6  (via drill 0.5)
  Top 0.356: 51.96,87.92 RB6.1
  Top 0.406: v61.41,80.62 60.03,80.62 arc45 R65.1 59.45,80.58 arc-45 57.65,81.32 52.23,86.74 arc-45 52.19,86.84 RB6.1 | v63.62,80.53 arc45 63.41,80.04 LMV2.9 | RB6.1 arc-45 51.73,88.34 | RB6_.1 52.15,88.13 arc45 RB6.1 | CT6.P$2 49.4,91.99 arc45 50.14,90.2 RB6.1
  Bottom 0.406: v61.41,80.62 61.42,80.63 63.37,80.63 arc-45 v63.62,80.53
CT_IN7
  Top 0.356: CT7.P$2 36.7,91.86 39.17,89.39 arc-45 39.2,89.33 39.2,88.07 RB7_.1 39.15,88.08 arc-45 RB7.1
  Top 0.406: R66.2 41.16,85.72 arc45 39.98,85.24 arc45 39.83,84.86 LMV3.2 39.83,86.49 arc45 RB7.1
CT_IN8
  Top 0.356: CT8.P$2 24,91.91 26.53,89.39 arc-45 26.55,89.33 RB8.1 | RB8.1 26.55,88.08 RB8_.1 | LMV3.6 34.75,84.55 arc45 34.37,85.48 34.29,85.55 arc45 33.74,85.78 32.73,85.78 arc45 32.24,85.58 arc-45 31.63,85.33 R67.2 29.87,85.33 arc-45 28.17,86.03 26.88,87.32 arc-45 RB8.1
CT_IN9
  Top 0.356: CT9.P$2 11.3,91.96 13.39,89.87 13.39,88.59 RB9.1 | RB9.1 13.9,88.05 arc45 13.82,88.08 RB9_.1 | R68.1 28.67,78.58 | 28.67,78.58 28.17,78.58 arc-45 26.37,79.32 22.59,83.1 arc45 20.8,83.84 17.97,83.84 arc-45 17.72,83.94 13.9,87.76 RB9.1 | 34.75,78.45 LMV3.9 LMV3.9 arc45 34.01,80.63 33.67,80.97 arc45 31.88,81.71 29.58,81.71 arc45 28.89,81.43 arc45 28.67,80.89 28.67,78.58
DGND  (via drill 0.5)
  Top 0.203: 14.45,41.44 RJ1.3
  Top 0.254: 71.5,49.56 STM32F303VET6.99 71.5,50.24 65.73,56.01 65.73,56.03 65.71,56.02 | 16.5,38.93 RJ1.5 10.86,38.93 v10.57,38.65 | 11.79,25.87 RJ2.3 10.76,25.87 10.65,25.75 | C40.2 arc45 18.01,44.01 RJ1.1 10.56,44.01 10.56,42.83 v10.51,42.78 10.6,42.69 10.6,41.44 14.45,41.44 | RJ2.5 v10.68,23.33 10.65,23.36 | C6.2 60.5,65.87 STM32F303VET6.49 60.5,62.04 | C8.2 72.66,66.17 71.5,65.01 STM32F303VET6.27 71.5,62.74 | C5.2 56.61,50.9 STM32F303VET6.74 61.03,50.9 65.71,55.59 65.71,56.02 | 65.71,56.02 65.71,56.83 | v88.89,55.7 88.22,55.7 | C22.2 v90.7,12.23 | PWR.C 121.92,34.13 U$2.P$4
  Top 0.3: v92.29,28.15 arc-90 92.25,28.19 R16.1 92.25,29.51 | v90.97,23.26 arc-90 91,23.23 R14.1 arc90 88.65,19.9 R15.1 | Q3.2 83.72,20.35 arc-90 v83.96,20.11 | 0.84,81.6 LED3.C 0.91,81.7 0.91,85.36 LED2.C LED1.C
  Top 0.305: C45.2 18.9,28.45 16.54,28.45 | C41.2 21.26,37.67 v21.68,37.26 | PCB2.P$70 24.94,40.16 arc-45 v24.82,40.21 | PCB2.P$74 25.04,35.08 arc45 v24.78,34.97 | v33.07,28.03 31.75,27.48 PCB2.P$79 | PCB2.P$65 32.86,45.24 arc45 v32.95,45.28 | PCB2.P$60 25.62,52.86 arc-45 v24.83,52.53 | PCB2.P$49 32.1,65.56 arc45 v32.97,65.92 | PCB2.P$54 25.05,60.48 arc45 v24.85,60.39 | PCB2.P$46 24.94,70.64 arc-45 v24.86,70.67 arc45 24.18,70.95 | 60.5,62.04 65.71,56.83 | 65.73,56.97 71.5,62.74 | D26.A 90.17,11.71 v90.7,12.23
  Top 0.35: 129.82,30.55 RST.1
  Top 0.406: v22.9,19.85 21.92,20.83 C46.2
  Top 0.5: v22.9,19.85 21.93,18.88 C47.2 | C27.2 C18.2 arc-45 22.04,70.95 v23.08,70.95 C28.2 24.18,70.95 arc-45 24.94,70.64 | v24.86,70.67 26.07,70.67 arc-45 PCB2.P$46
  Top 1.27: U$2.P$4 U$2.P$2 | U$2.P$3 U$2.P$1
  Bottom 0.254: U1.39 58.02,34.26 v57.97,34.38
  Bottom 0.406: C26.2 43.08,26.94 arc-45 C25.2 | C25.2 arc-45 C25.2 | C25.2 C24.2 | 48.42,26.93 arc45 48.97,27.16 arc-45 49.54,27.39 U1.1
  Bottom 0.5: U1.38 66.18,27.39 arc-45 64.38,28.14 U1.39 58.27,35.54 arc-45 60.07,36.28 U1.31 | U1.15 52.9,43.08 arc45 54.09,40.21 57.39,36.91 v57.39,36.82 | U1.1 51.35,27.39 arc45 52.62,27.92 58.15,33.45 v58.15,35.59